# EAGLE design cpu_eval_board (EAGLE 6.3)

## Sheet 1 of 3
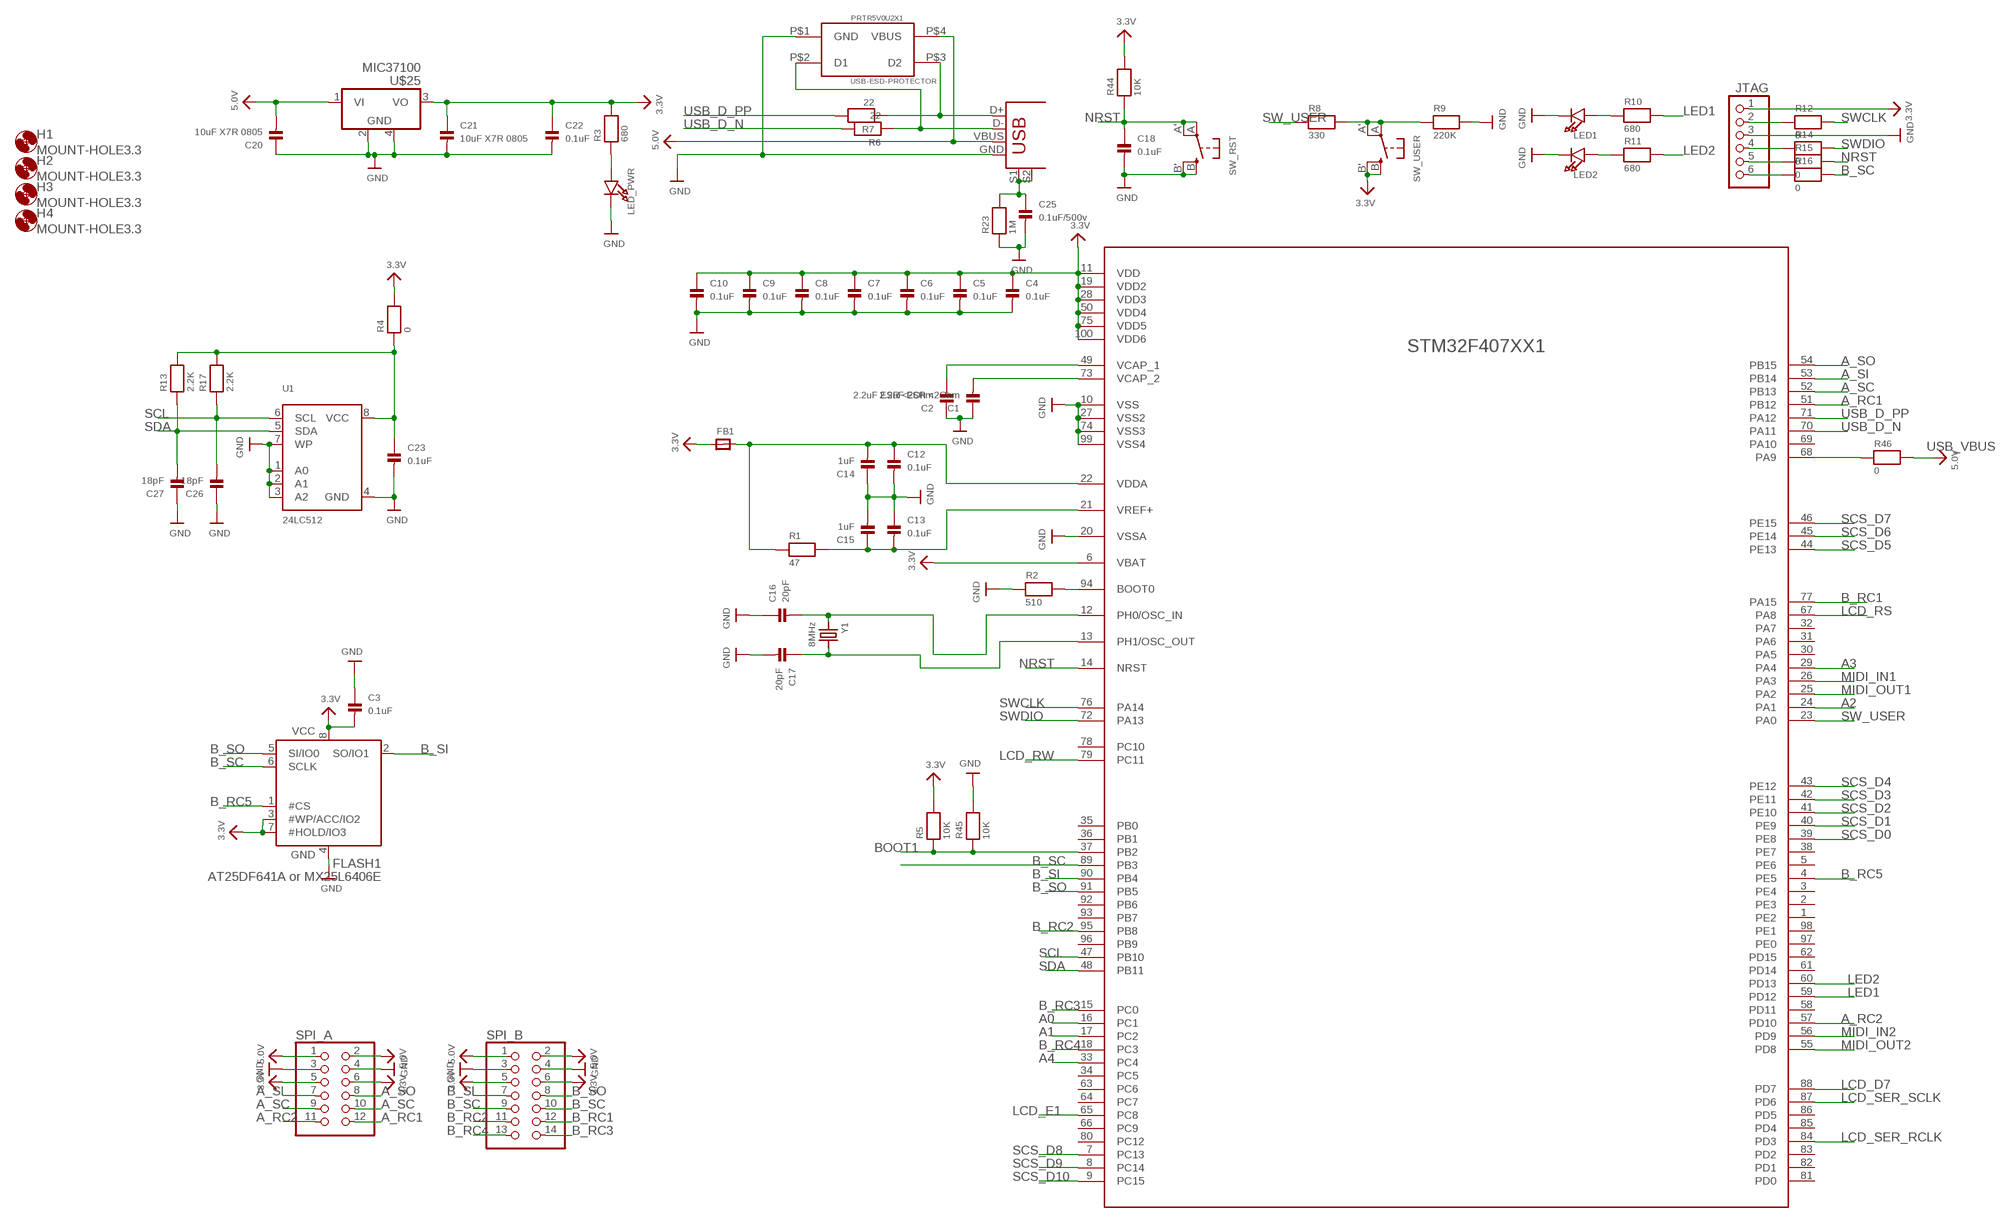
[diagram p0: schematic, sheet 1]

### Parts
C1  2.2uF ESR <2Ohm  CAP_CERAMIC0603  [0603]
C2  2.2uF ESR <2Ohm  CAP_CERAMIC0603  [0603]
C3  0.1uF  CAP_CERAMIC0603  [0603]
C4  0.1uF  CAP_CERAMIC0603  [0603]
C5  0.1uF  CAP_CERAMIC0603  [0603]
C6  0.1uF  CAP_CERAMIC0603  [0603]
C7  0.1uF  CAP_CERAMIC0603  [0603]
C8  0.1uF  CAP_CERAMIC0603  [0603]
C9  0.1uF  CAP_CERAMIC0603  [0603]
C10  0.1uF  CAP_CERAMIC0603  [0603]
C12  0.1uF  CAP_CERAMIC0603  [0603]
C13  0.1uF  CAP_CERAMIC0603  [0603]
C14  1uF  CAP_CERAMIC0603  [0603]
C15  1uF  CAP_CERAMIC0603  [0603]
C16  20pF  CAP_CERAMIC0603  [0603]
C17  20pF  CAP_CERAMIC0603  [0603]
C18  0.1uF  CAP_CERAMIC0603  [0603]
C20  10uF X7R 0805  CAP_CERAMIC_0805  [_0805]
C21  10uF X7R 0805  CAP_CERAMIC_0805  [_0805]
C22  0.1uF  CAP_CERAMIC0603  [0603]
C23  0.1uF  CAP_CERAMIC0603  [0603]
C25  0.1uF/500v  CAP_CERAMIC0603  [0603]
C26  18pF  CAP_CERAMIC0603  [0603]
C27  18pF  CAP_CERAMIC0603  [0603]
FB1  FERRITE_0805  [_0805]
FLASH1  AT25DF641A or MX25L6406E  FLASH-SPI  [SOIC-8-WIDE]
H1  MOUNT-HOLE3.3  [3,3]
H2  MOUNT-HOLE3.3  [3,3]
H3  MOUNT-HOLE3.3  [3,3]
H4  MOUNT-HOLE3.3  [3,3]
JTAG  HEADER-1X6ROUND  [1X06_ROUND]
LED1  LED0603  [CHIPLED_0603]
LED2  LED0603  [CHIPLED_0603]
LED_PWR  LED0603  [CHIPLED_0603]
PRTR5V0U2X1  USB-ESD-PROTECTOR  [PRTR5V0U2X]
R1  47  RESISTOR0603  [0603]
R2  510  RESISTOR0603  [0603]
R3  680  RESISTOR0603  [0603]
R4  0  RESISTOR0603  [0603]
R5  10K  RESISTOR0603  [0603]
R6  22  RESISTOR0603  [0603]
R7  22  RESISTOR0603  [0603]
R8  330  RESISTOR0603  [0603]
R9  220K  RESISTOR0603  [0603]
R10  680  RESISTOR0603  [0603]
R11  680  RESISTOR0603  [0603]
R12  0  RESISTOR0603  [0603]
R13  2.2K  RESISTOR0603  [0603]
R14  0  RESISTOR0603  [0603]
R15  0  RESISTOR0603  [0603]
R16  0  RESISTOR0603  [0603]
R17  2.2K  RESISTOR0603  [0603]
R23  1M  RESISTOR0603  [0603]
R44  10K  RESISTOR0603  [0603]
R45  10K  RESISTOR0603  [0603]
R46  0  RESISTOR0603  [0603]
SPI_A  PINHD-2X6  [2X06]
SPI_B  PINHD-2X7  [2X07]
STM32F407XX1  STM32F407  [100LQFP]
SW_RST  SWITCH_TACT_SMT  [EVQ-Q2]
SW_USER  SWITCH_TACT_SMT  [EVQ-Q2]
U1  24LC512  EEPROM_I2C_SOIC8_GENERIC  [SOIC8_150MIL]
U$14  Molex 67068-9001  USB+SHIELD  [USB-B-PTH]
U$25  MIC37100  [SOT223]
Y1  8MHz  CRYSTALSMD  [HC49UP]

### Nets
3.3V: C3.2 C4.1 C5.1 C6.1 C7.1 C8.1 C9.1 C10.1 C21.1 C22.1 FB1.1 FLASH1.3(#WP/ACC/IO2) FLASH1.7(#HOLD/IO3) FLASH1.8(VCC) JTAG.1 R3.2 R4.2 R5.2 R44.2 SPI_A.5 SPI_A.6 SPI_B.5 SPI_B.6 STM32F407XX1.6(VBAT) STM32F407XX1.11(VDD) STM32F407XX1.19(VDD2) STM32F407XX1.28(VDD3) STM32F407XX1.50(VDD4) STM32F407XX1.75(VDD5) STM32F407XX1.100(VDD6) SW_USER.B'(S1) SW_USER.B(S) U$25.3(VO) ; also sheet 2
5.0V: C20.2 PRTR5V0U2X1.P$4(VBUS) R46.2 SPI_A.1 SPI_A.2 SPI_B.1 SPI_B.2 U$14.VBUS U$25.1(VI) ; also sheet 2,3
A0: STM32F407XX1.16(PC1) ; also sheet 2
A1: STM32F407XX1.17(PC2) ; also sheet 2
A2: STM32F407XX1.24(PA1) ; also sheet 2
A3: STM32F407XX1.29(PA4) ; also sheet 2
A4: STM32F407XX1.33(PC4) ; also sheet 2
A_RC1: SPI_A.12 STM32F407XX1.51(PB12)
A_RC2: SPI_A.11 STM32F407XX1.57(PD10)
A_SC: SPI_A.9 SPI_A.10 STM32F407XX1.52(PB13)
A_SI: SPI_A.7 STM32F407XX1.53(PB14)
A_SO: SPI_A.8 STM32F407XX1.54(PB15)
B_RC1: SPI_B.12 STM32F407XX1.77(PA15)
B_RC2: SPI_B.11 STM32F407XX1.95(PB8)
B_RC3: SPI_B.14 STM32F407XX1.15(PC0)
B_RC4: SPI_B.13 STM32F407XX1.18(PC3)
B_RC5: FLASH1.1(#CS) STM32F407XX1.4(PE5)
B_SC: FLASH1.6(SCLK) R16.2 SPI_B.9 SPI_B.10 STM32F407XX1.89(PB3)
B_SI: FLASH1.2(SO/IO1) SPI_B.7 STM32F407XX1.90(PB4)
B_SO: FLASH1.5(SI/IO0) SPI_B.8 STM32F407XX1.91(PB5)
BOOT1: R5.1 R45.1 STM32F407XX1.37(PB2)
GND: C1.1 C2.1 C3.1 C4.2 C5.2 C6.2 C7.2 C8.2 C9.2 C10.2 C12.2 C13.1 C14.1 C15.2 C16.1 C17.2 C18.2 C20.1 C21.2 C22.2 C23.2 C25.2 C26.1 C27.1 FLASH1.4(GND) JTAG.3 LED1.C LED2.C LED_PWR.C PRTR5V0U2X1.P$1(GND) R2.1 R9.2 R23.1 R45.2 SPI_A.3 SPI_A.4 SPI_B.3 SPI_B.4 STM32F407XX1.10(VSS) STM32F407XX1.20(VSSA) STM32F407XX1.27(VSS2) STM32F407XX1.74(VSS3) STM32F407XX1.99(VSS4) SW_RST.B'(S1) SW_RST.B(S) U1.1(A0) U1.2(A1) U1.3(A2) U1.4(GND) U1.7(WP) U$14.GND U$25.2(GND) U$25.4(GND_TAB) ; also sheet 2,3
LCD_D7: STM32F407XX1.88(PD7) ; also sheet 2
LCD_E1: STM32F407XX1.65(PC8) ; also sheet 2
LCD_RS: STM32F407XX1.67(PA8) ; also sheet 2
LCD_RW: STM32F407XX1.79(PC11) ; also sheet 2
LCD_SER_RCLK: STM32F407XX1.84(PD3) ; also sheet 2
LCD_SER_SCLK: STM32F407XX1.87(PD6) ; also sheet 2
LED1: R10.2 STM32F407XX1.59(PD12)
LED2: R11.2 STM32F407XX1.60(PD13)
MIDI_IN1: STM32F407XX1.26(PA3) ; also sheet 3
MIDI_IN2: STM32F407XX1.56(PD9) ; also sheet 3
MIDI_OUT1: STM32F407XX1.25(PA2) ; also sheet 3
MIDI_OUT2: STM32F407XX1.55(PD8) ; also sheet 3
N$1: C2.2 STM32F407XX1.49(VCAP_1)
N$2: C1.2 STM32F407XX1.73(VCAP_2)
N$3: R46.1 STM32F407XX1.68(PA9)
N$5: R2.2 STM32F407XX1.94(BOOT0)
N$6: C16.2 STM32F407XX1.12(PH0/OSC_IN) Y1.1
N$7: C23.1 R4.1 R13.2 R17.2 U1.8(VCC)
N$8: LED_PWR.A R3.1
N$9: C17.1 STM32F407XX1.13(PH1/OSC_OUT) Y1.2
N$10: PRTR5V0U2X1.P$2(D1) R6.1 U$14.D-
N$11: PRTR5V0U2X1.P$3(D2) R7.1 U$14.D+
N$12: R8.2 R9.1 SW_USER.A'(P1) SW_USER.A(P)
N$13: LED1.A R10.1
N$14: LED2.A R11.1
N$15: JTAG.2 R12.1
N$16: JTAG.4 R14.1
N$17: JTAG.5 R15.1
N$18: JTAG.6 R16.1
N$21: C25.1 R23.2 U$14.S1 U$14.S2
NRST: C18.1 R15.2 R44.1 STM32F407XX1.14(NRST) SW_RST.A'(P1) SW_RST.A(P)
SCL: C26.2 R17.1 STM32F407XX1.47(PB10) U1.6(SCL)
SCS_D0: STM32F407XX1.39(PE8) ; also sheet 2
SCS_D1: STM32F407XX1.40(PE9) ; also sheet 2
SCS_D2: STM32F407XX1.41(PE10) ; also sheet 2
SCS_D3: STM32F407XX1.42(PE11) ; also sheet 2
SCS_D4: STM32F407XX1.43(PE12) ; also sheet 2
SCS_D5: STM32F407XX1.44(PE13) ; also sheet 2
SCS_D6: STM32F407XX1.45(PE14) ; also sheet 2
SCS_D7: STM32F407XX1.46(PE15) ; also sheet 2
SCS_D8: STM32F407XX1.7(PC13) ; also sheet 2
SCS_D9: STM32F407XX1.8(PC14) ; also sheet 2
SCS_D10: STM32F407XX1.9(PC15) ; also sheet 2
SDA: C27.2 R13.1 STM32F407XX1.48(PB11) U1.5(SDA)
SW_USER: R8.1 STM32F407XX1.23(PA0)
SWCLK: R12.2 STM32F407XX1.76(PA14)
SWDIO: R14.2 STM32F407XX1.72(PA13)
USB_D_N: R6.2 STM32F407XX1.70(PA11)
USB_D_PP: R7.2 STM32F407XX1.71(PA12)
VDDA: C12.1 C14.2 FB1.2 R1.1 STM32F407XX1.22(VDDA)
VREF: C13.2 C15.1 R1.2 STM32F407XX1.21(VREF+)
Unconnected: STM32F407XX1.1(PE2) STM32F407XX1.2(PE3) STM32F407XX1.3(PE4) STM32F407XX1.5(PE6) STM32F407XX1.30(PA5) STM32F407XX1.31(PA6) STM32F407XX1.32(PA7) STM32F407XX1.34(PC5) STM32F407XX1.35(PB0) STM32F407XX1.36(PB1) STM32F407XX1.38(PE7) STM32F407XX1.58(PD11) STM32F407XX1.61(PD14) STM32F407XX1.62(PD15) STM32F407XX1.63(PC6) STM32F407XX1.64(PC7) STM32F407XX1.66(PC9) STM32F407XX1.69(PA10) STM32F407XX1.78(PC10) STM32F407XX1.80(PC12) STM32F407XX1.81(PD0) STM32F407XX1.82(PD1) STM32F407XX1.83(PD2) STM32F407XX1.85(PD4) STM32F407XX1.86(PD5) STM32F407XX1.92(PB6) STM32F407XX1.93(PB7) STM32F407XX1.96(PB9) STM32F407XX1.97(PE0) STM32F407XX1.98(PE1)

### Notes on the sheet
- USB_VBUS

## Sheet 2 of 3
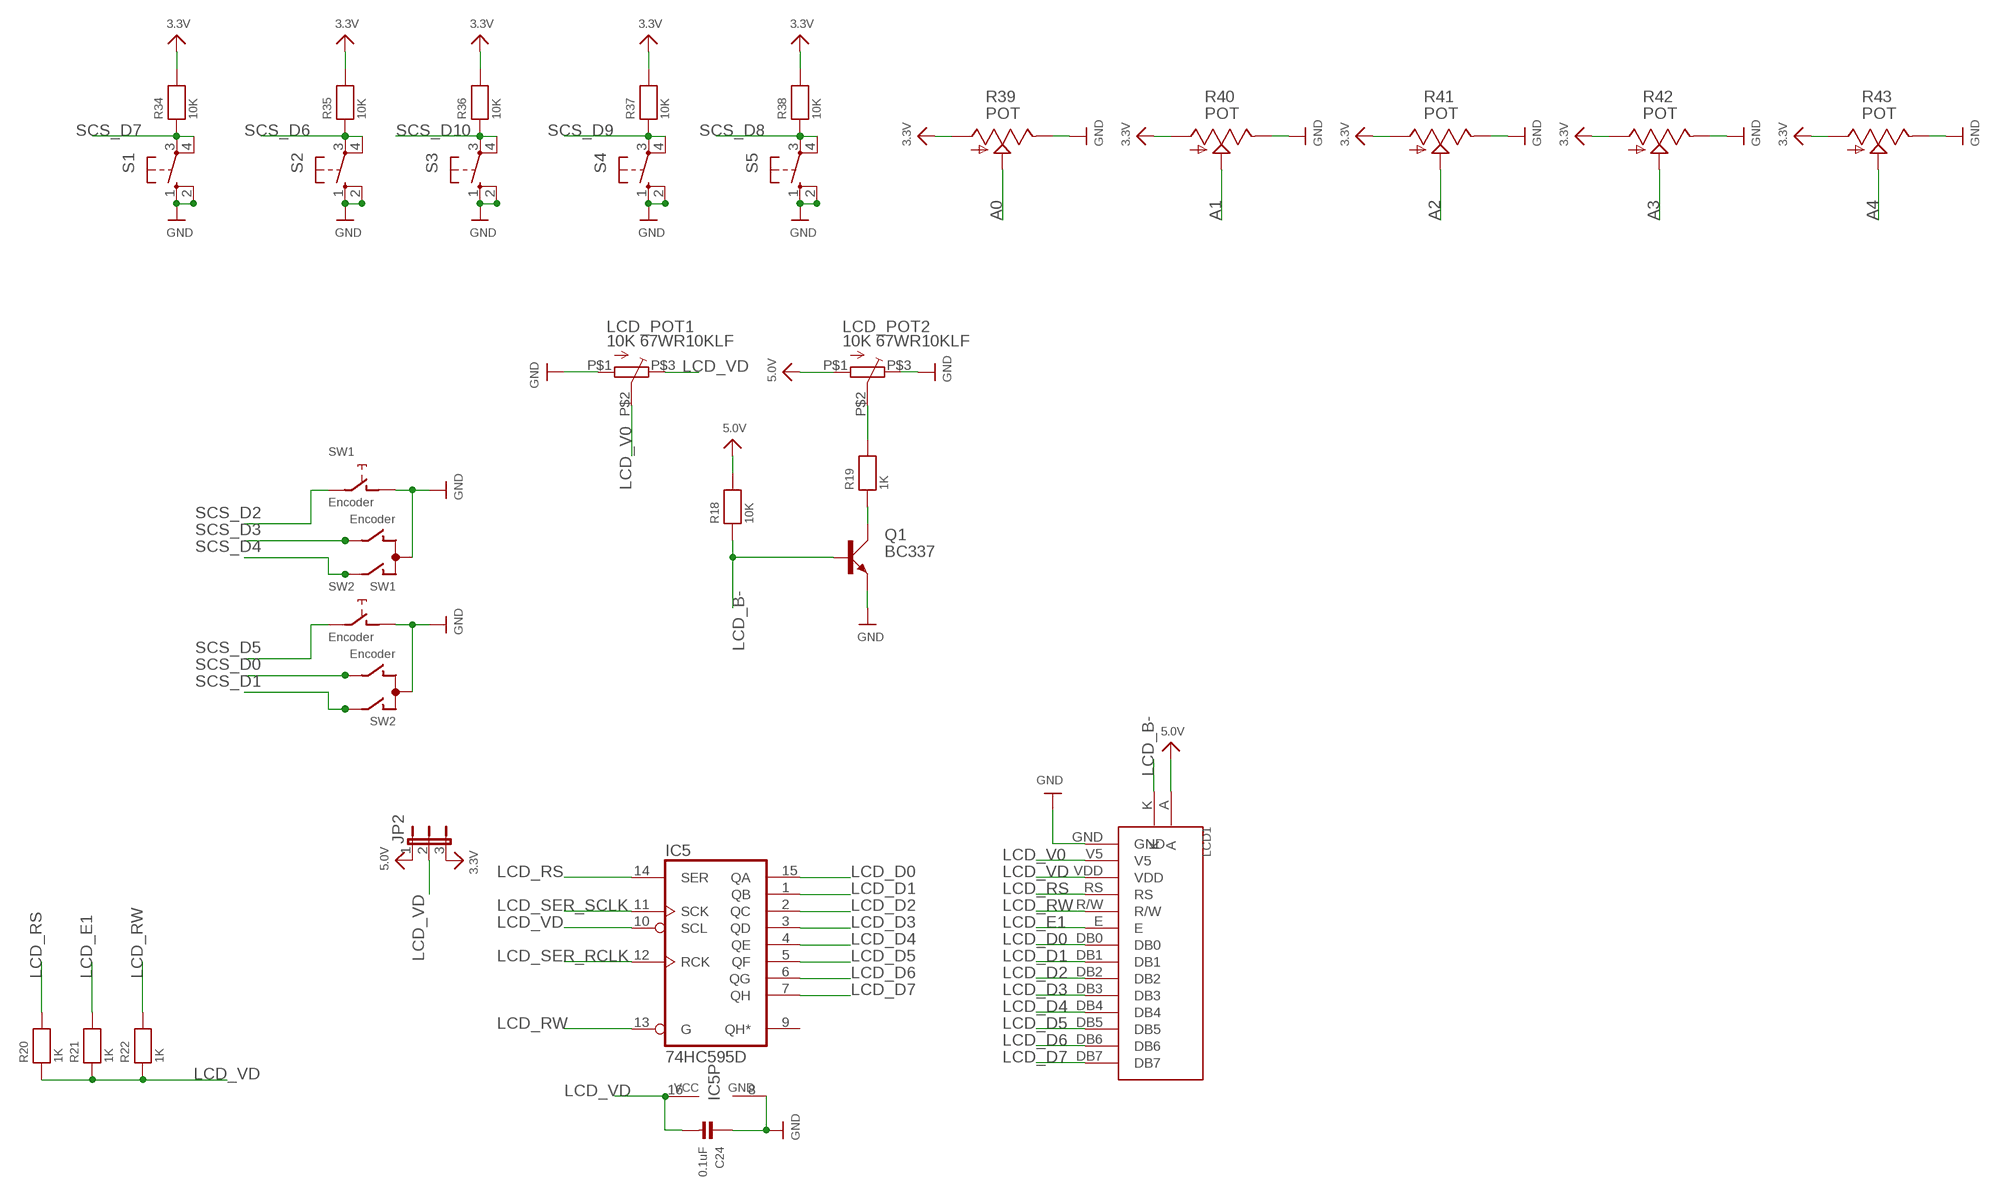
[diagram p1: schematic, sheet 2]

### Parts
C24  0.1uF  CAP_CERAMIC0603  [0603]
IC5  74HC595D  [SO16]
JP2  JUMPER3  [JUMPER3]
LCD1  NHD-C0220AA-FSW-FTW  [NHD-C0220AA-FSW-FTW]
LCD_POT1  10K 67WR10KLF  TRIMPOT-67W  [67W]
LCD_POT2  10K 67WR10KLF  TRIMPOT-67W  [67W]
Q1  BC337  [SOT54A]
R18  10K  RESISTOR_0603  [_0603]
R19  1K  RESISTOR_0603  [_0603]
R20  1K  RESISTOR_0603  [_0603]
R21  1K  RESISTOR_0603  [_0603]
R22  1K  RESISTOR_0603  [_0603]
R34  10K  RESISTOR_0603  [_0603]
R35  10K  RESISTOR_0603  [_0603]
R36  10K  RESISTOR_0603  [_0603]
R37  10K  RESISTOR_0603  [_0603]
R38  10K  RESISTOR_0603  [_0603]
R39  POT  POT_US  [ALPS_POT_SFE]
R40  POT  POT_US  [ALPS_POT_SFE]
R41  POT  POT_US  [ALPS_POT_SFE]
R42  POT  POT_US  [ALPS_POT_SFE]
R43  POT  POT_US  [ALPS_POT_SFE]
S1  40-XX  [B3F-40XX]
S2  40-XX  [B3F-40XX]
S3  40-XX  [B3F-40XX]
S4  40-XX  [B3F-40XX]
S5  40-XX  [B3F-40XX]
SW1  Encoder  EC12E_SW  [ALPS_EC12E_SW]
SW2  Encoder  EC12E_SW  [ALPS_EC12E_SW]

### Nets
3.3V: JP2.3 R34.2 R35.2 R36.2 R37.2 R38.2 R39.P$3(A) R40.P$3(A) R41.P$3(A) R42.P$3(A) R43.P$3(A) ; also sheet 1
5.0V: JP2.1 LCD1.A LCD_POT2.P$1(A) R18.2 ; also sheet 1,3
A0: R39.P$2(S) ; also sheet 1
A1: R40.P$2(S) ; also sheet 1
A2: R41.P$2(S) ; also sheet 1
A3: R42.P$2(S) ; also sheet 1
A4: R43.P$2(S) ; also sheet 1
GND: C24.1 IC5.8(GND) LCD1.GND LCD_POT1.P$1(A) LCD_POT2.P$3(E) Q1.E R39.P$1(E) R40.P$1(E) R41.P$1(E) R42.P$1(E) R43.P$1(E) S1.1(S) S1.2(S1) S2.1(S) S2.2(S1) S3.1(S) S3.2(S1) S4.1(S) S4.2(S1) S5.1(S) S5.2(S1) SW1.C SW1.D SW2.C SW2.D ; also sheet 1,3
LCD_B-: LCD1.K Q1.B R18.1
LCD_D0: IC5.15(QA) LCD1.DB0
LCD_D1: IC5.1(QB) LCD1.DB1
LCD_D2: IC5.2(QC) LCD1.DB2
LCD_D3: IC5.3(QD) LCD1.DB3
LCD_D4: IC5.4(QE) LCD1.DB4
LCD_D5: IC5.5(QF) LCD1.DB5
LCD_D6: IC5.6(QG) LCD1.DB6
LCD_D7: IC5.7(QH) LCD1.DB7 ; also sheet 1
LCD_E1: LCD1.E R21.2 ; also sheet 1
LCD_RS: IC5.14(SER) LCD1.RS R20.2 ; also sheet 1
LCD_RW: IC5.13(G) LCD1.R/W R22.2 ; also sheet 1
LCD_SER_RCLK: IC5.12(RCK) ; also sheet 1
LCD_SER_SCLK: IC5.11(SCK) ; also sheet 1
LCD_V0: LCD1.V5 LCD_POT1.P$2(S)
LCD_VD: C24.2 IC5.10(SCL) IC5.16(VCC) JP2.2 LCD1.VDD LCD_POT1.P$3(E) R20.1 R21.1 R22.1
N$19: Q1.C R19.1
N$20: LCD_POT2.P$2(S) R19.2
SCS_D0: SW2.B ; also sheet 1
SCS_D1: SW2.A ; also sheet 1
SCS_D2: SW1.E ; also sheet 1
SCS_D3: SW1.B ; also sheet 1
SCS_D4: SW1.A ; also sheet 1
SCS_D5: SW2.E ; also sheet 1
SCS_D6: R35.1 S2.3(P) S2.4(P1) ; also sheet 1
SCS_D7: R34.1 S1.3(P) S1.4(P1) ; also sheet 1
SCS_D8: R38.1 S5.3(P) S5.4(P1) ; also sheet 1
SCS_D9: R37.1 S4.3(P) S4.4(P1) ; also sheet 1
SCS_D10: R36.1 S3.3(P) S3.4(P1) ; also sheet 1
Unconnected: IC5.9(QH*) SW1.GND1(G) SW1.GND2(G) SW2.GND1(G) SW2.GND2(G)

## Sheet 3 of 3
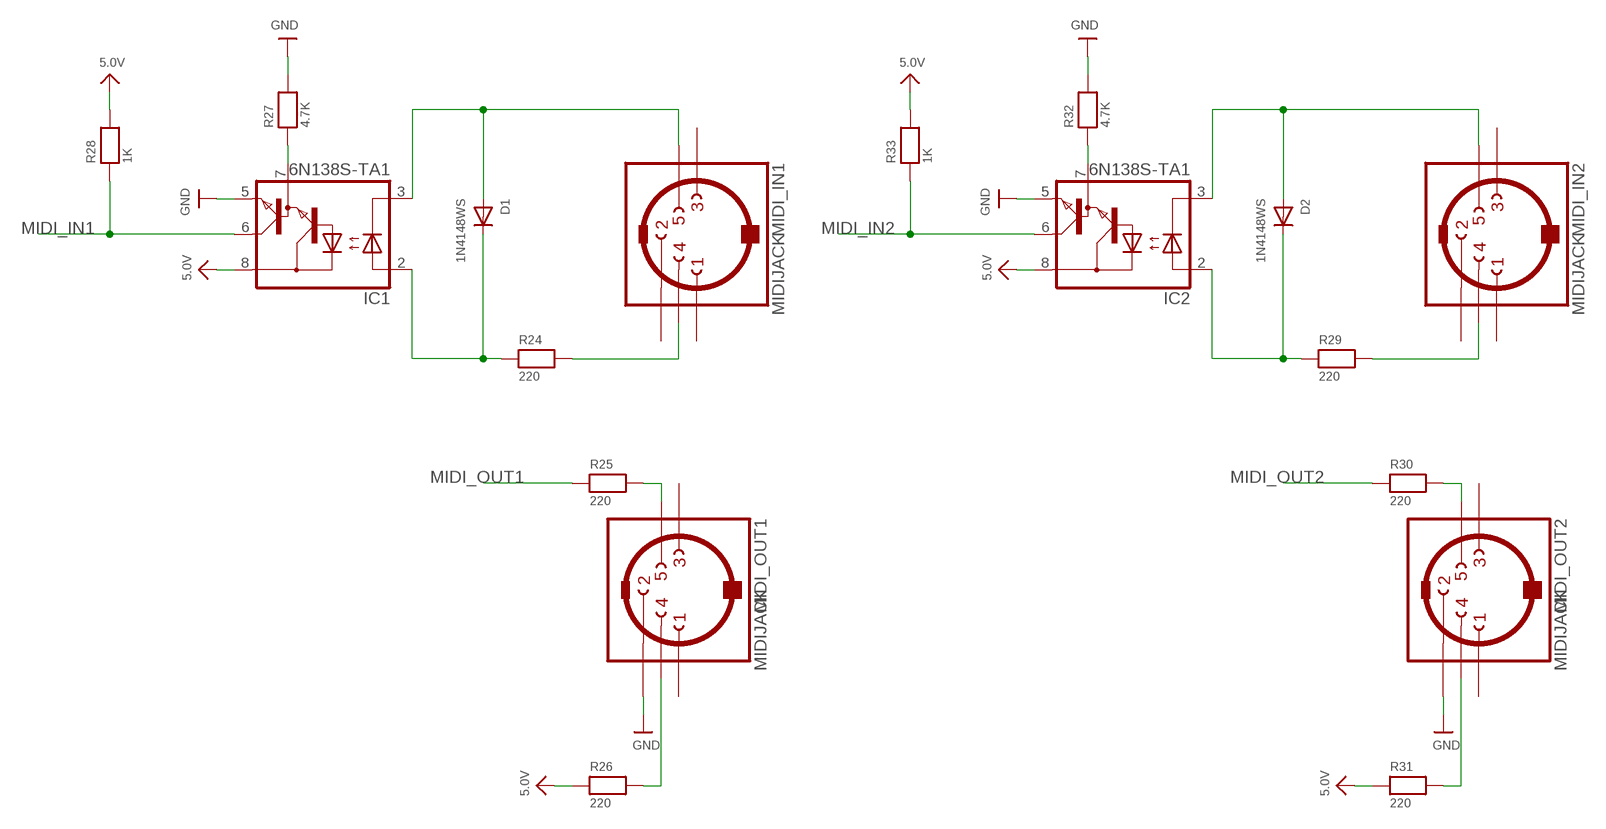
[diagram p2: schematic, sheet 3]

### Parts
D1  1N4148WS  DIODESOD-323  [SOD-323]
D2  1N4148WS  DIODESOD-323  [SOD-323]
IC1  6N138S-TA1  6N138SMD  [SO8-GW300]
IC2  6N138S-TA1  6N138SMD  [SO8-GW300]
MIDI_IN1  MIDIJACK  [CP-2350]
MIDI_IN2  MIDIJACK  [CP-2350]
MIDI_OUT1  MIDIJACK  [CP-2350]
MIDI_OUT2  MIDIJACK  [CP-2350]
R24  220  RESISTOR_0603  [_0603]
R25  220  RESISTOR_0603  [_0603]
R26  220  RESISTOR_0603  [_0603]
R27  4.7K  RESISTOR_0603  [_0603]
R28  1K  RESISTOR_0603  [_0603]
R29  220  RESISTOR_0603  [_0603]
R30  220  RESISTOR_0603  [_0603]
R31  220  RESISTOR_0603  [_0603]
R32  4.7K  RESISTOR_0603  [_0603]
R33  1K  RESISTOR_0603  [_0603]

### Nets
5.0V: IC1.8(VCC) IC2.8(VCC) R26.1 R28.2 R31.1 R33.2 ; also sheet 1,2
GND: IC1.5(GND) IC2.5(GND) MIDI_OUT1.2 MIDI_OUT2.2 R27.2 R32.2 ; also sheet 1,2
MIDI_IN1: IC1.6(VO) R28.1 ; also sheet 1
MIDI_IN2: IC2.6(VO) R33.1 ; also sheet 1
MIDI_OUT1: R25.1 ; also sheet 1
MIDI_OUT2: R30.1 ; also sheet 1
N$23: MIDI_OUT1.5 R25.2
N$24: MIDI_OUT1.4 R26.2
N$25: MIDI_IN1.4 R24.2
N$26: D1.C IC1.2(A) R24.1
N$27: D1.A IC1.3(C) MIDI_IN1.5
N$28: IC1.7(VB) R27.1
N$29: MIDI_OUT2.5 R30.2
N$30: MIDI_OUT2.4 R31.2
N$31: MIDI_IN2.4 R29.2
N$32: D2.C IC2.2(A) R29.1
N$33: D2.A IC2.3(C) MIDI_IN2.5
N$34: IC2.7(VB) R32.1
Unconnected: MIDI_IN1.1 MIDI_IN1.2 MIDI_IN1.3 MIDI_IN2.1 MIDI_IN2.2 MIDI_IN2.3 MIDI_OUT1.1 MIDI_OUT1.3 MIDI_OUT2.1 MIDI_OUT2.3

## Library data of the parts
C1 C2 = microbuilder:CAP_CERAMIC: Ceramic Capacitors 0402 - 0402 Surface Mount Capacitors 16pF 50V 5% [Digikey: 445-4899-2-ND] 18pF 50V 5% [Digikey: 490-1281-2-ND] 22pF 50V 5% [Digikey: 490-1283-2-ND] 68pF 50V 5% [Digikey: 490-1289-2-ND] 0.1uF 10V 10% [Digikey: 490-1318-2-ND] 1.0uF 6.3V 10% [Digikey: 490-1320-2-ND] 0603 - 0603 Surface Mount Capacitors 16 pF 50V 5% [Digikey: 445-5051-2-ND] 22 pF 50V [Digikey: PCC220ACVTR-ND] 33 pF 50V 5% [Digikey: 490-1415-1-ND] 56pF 50V 5% [Digikey: 490-1421-1-ND] 220pF 50V 5% [Digikey: 445-1285-1-ND] 680 pF 50V 2200 pF 50V 5% C0G [Digikey: 445-1297-1-ND] 5600 pF 100V 5% X7R [Digikey: 478-3711-1-ND] 0.1 µF 25V 10% [Digikey: PCC2277TR-ND] 0.22 µF 16V 10% X7R [Digikey: 445-1318-1-ND] 1.0 µF 25V 10% [Digikey: 445-5146-2-ND] 0603 - RF Specific 3pF 250V +/-0.1pF RF [Digikey: 712-1347-1-ND] 18 pF 250V 5% [Digikey: 478-3505-1-ND or 712-1322-1-ND] 56 pF 250V 5% C0G RF [Digikey: 490-4867-1-ND] 68 pF 250V RF [Digikey: 490-4868-1-ND] 0805 - 0805 Surface Mount Capacitors 220 pF 250V 2% RF Ceramic Capacitor [Digikey: 712-1398-1-ND] 1000 pF 50V 2% NP0 Ceramic Capacitor [Digikey: 478-3760-1-ND] 0.1 µF 25V 10% Ceramic Capacitor [Digikey: PCC1828TR-ND] 1.0 µF 16V 10% Ceramic Capacitor[Digikey: 490-1691-2-ND] 10.0 µF 10V 10% Ceramic Capacitor[Digikey: 709-1228-1-ND] 10.0 uF 16V 10% Ceramic Capacitor [Digikey: 478-5165-2-ND] 47 uF 6.3V 20% Ceramic Capacitor [Digikey: 587-1779-1-ND or 399-5506-1-ND] 1206 - 1206 Surface Mount Capacitors 47uF 10V 20% Ceramic Capacitor [Digikey: 490-5528-1-ND or 399-5508-1-ND or 445-6010-1-ND] 100uF 6.3V -20%, +80% Y5V Ceramic Capacitor (Digikey: 490-4512-1-ND, Mouser: 81-GRM31CF50J107ZE1L); PARTNO: GRM188R61E225KA12D,Murata Electronics,,81-GRM188R61E225KA2D,Multilayer Ceramic Capacitors MLCC - SMD/SMT 0603 2.2uF 25volts X5R 10%, REF25
C3-C10 C12 C13 C18 C22-C24 = microbuilder:CAP_CERAMIC: Ceramic Capacitors 0402 - 0402 Surface Mount Capacitors 16pF 50V 5% [Digikey: 445-4899-2-ND] 18pF 50V 5% [Digikey: 490-1281-2-ND] 22pF 50V 5% [Digikey: 490-1283-2-ND] 68pF 50V 5% [Digikey: 490-1289-2-ND] 0.1uF 10V 10% [Digikey: 490-1318-2-ND] 1.0uF 6.3V 10% [Digikey: 490-1320-2-ND] 0603 - 0603 Surface Mount Capacitors 16 pF 50V 5% [Digikey: 445-5051-2-ND] 22 pF 50V [Digikey: PCC220ACVTR-ND] 33 pF 50V 5% [Digikey: 490-1415-1-ND] 56pF 50V 5% [Digikey: 490-1421-1-ND] 220pF 50V 5% [Digikey: 445-1285-1-ND] 680 pF 50V 2200 pF 50V 5% C0G [Digikey: 445-1297-1-ND] 5600 pF 100V 5% X7R [Digikey: 478-3711-1-ND] 0.1 µF 25V 10% [Digikey: PCC2277TR-ND] 0.22 µF 16V 10% X7R [Digikey: 445-1318-1-ND] 1.0 µF 25V 10% [Digikey: 445-5146-2-ND] 0603 - RF Specific 3pF 250V +/-0.1pF RF [Digikey: 712-1347-1-ND] 18 pF 250V 5% [Digikey: 478-3505-1-ND or 712-1322-1-ND] 56 pF 250V 5% C0G RF [Digikey: 490-4867-1-ND] 68 pF 250V RF [Digikey: 490-4868-1-ND] 0805 - 0805 Surface Mount Capacitors 220 pF 250V 2% RF Ceramic Capacitor [Digikey: 712-1398-1-ND] 1000 pF 50V 2% NP0 Ceramic Capacitor [Digikey: 478-3760-1-ND] 0.1 µF 25V 10% Ceramic Capacitor [Digikey: PCC1828TR-ND] 1.0 µF 16V 10% Ceramic Capacitor[Digikey: 490-1691-2-ND] 10.0 µF 10V 10% Ceramic Capacitor[Digikey: 709-1228-1-ND] 10.0 uF 16V 10% Ceramic Capacitor [Digikey: 478-5165-2-ND] 47 uF 6.3V 20% Ceramic Capacitor [Digikey: 587-1779-1-ND or 399-5506-1-ND] 1206 - 1206 Surface Mount Capacitors 47uF 10V 20% Ceramic Capacitor [Digikey: 490-5528-1-ND or 399-5508-1-ND or 445-6010-1-ND] 100uF 6.3V -20%, +80% Y5V Ceramic Capacitor (Digikey: 490-4512-1-ND, Mouser: 81-GRM31CF50J107ZE1L); PARTNO: VJ0603Y104JXJPW1BC,Vishay / Vitramon,,77-VJ0603Y104JXJPBC,Multilayer Ceramic Capacitors MLCC - SMD/SMT 0603 0.1uF 16volts X7R 5%, REF44
C14 C15 = microbuilder:CAP_CERAMIC: Ceramic Capacitors 0402 - 0402 Surface Mount Capacitors 16pF 50V 5% [Digikey: 445-4899-2-ND] 18pF 50V 5% [Digikey: 490-1281-2-ND] 22pF 50V 5% [Digikey: 490-1283-2-ND] 68pF 50V 5% [Digikey: 490-1289-2-ND] 0.1uF 10V 10% [Digikey: 490-1318-2-ND] 1.0uF 6.3V 10% [Digikey: 490-1320-2-ND] 0603 - 0603 Surface Mount Capacitors 16 pF 50V 5% [Digikey: 445-5051-2-ND] 22 pF 50V [Digikey: PCC220ACVTR-ND] 33 pF 50V 5% [Digikey: 490-1415-1-ND] 56pF 50V 5% [Digikey: 490-1421-1-ND] 220pF 50V 5% [Digikey: 445-1285-1-ND] 680 pF 50V 2200 pF 50V 5% C0G [Digikey: 445-1297-1-ND] 5600 pF 100V 5% X7R [Digikey: 478-3711-1-ND] 0.1 µF 25V 10% [Digikey: PCC2277TR-ND] 0.22 µF 16V 10% X7R [Digikey: 445-1318-1-ND] 1.0 µF 25V 10% [Digikey: 445-5146-2-ND] 0603 - RF Specific 3pF 250V +/-0.1pF RF [Digikey: 712-1347-1-ND] 18 pF 250V 5% [Digikey: 478-3505-1-ND or 712-1322-1-ND] 56 pF 250V 5% C0G RF [Digikey: 490-4867-1-ND] 68 pF 250V RF [Digikey: 490-4868-1-ND] 0805 - 0805 Surface Mount Capacitors 220 pF 250V 2% RF Ceramic Capacitor [Digikey: 712-1398-1-ND] 1000 pF 50V 2% NP0 Ceramic Capacitor [Digikey: 478-3760-1-ND] 0.1 µF 25V 10% Ceramic Capacitor [Digikey: PCC1828TR-ND] 1.0 µF 16V 10% Ceramic Capacitor[Digikey: 490-1691-2-ND] 10.0 µF 10V 10% Ceramic Capacitor[Digikey: 709-1228-1-ND] 10.0 uF 16V 10% Ceramic Capacitor [Digikey: 478-5165-2-ND] 47 uF 6.3V 20% Ceramic Capacitor [Digikey: 587-1779-1-ND or 399-5506-1-ND] 1206 - 1206 Surface Mount Capacitors 47uF 10V 20% Ceramic Capacitor [Digikey: 490-5528-1-ND or 399-5508-1-ND or 445-6010-1-ND] 100uF 6.3V -20%, +80% Y5V Ceramic Capacitor (Digikey: 490-4512-1-ND, Mouser: 81-GRM31CF50J107ZE1L); PARTNO: GRM188R61E105KA12D,Murata Electronics,,81-GRM188R61E105KA12,Multilayer Ceramic Capacitors MLCC - SMD/SMT 0603 1uF 25volts X5R 10%, REF23
C16 C17 = microbuilder:CAP_CERAMIC: Ceramic Capacitors 0402 - 0402 Surface Mount Capacitors 16pF 50V 5% [Digikey: 445-4899-2-ND] 18pF 50V 5% [Digikey: 490-1281-2-ND] 22pF 50V 5% [Digikey: 490-1283-2-ND] 68pF 50V 5% [Digikey: 490-1289-2-ND] 0.1uF 10V 10% [Digikey: 490-1318-2-ND] 1.0uF 6.3V 10% [Digikey: 490-1320-2-ND] 0603 - 0603 Surface Mount Capacitors 16 pF 50V 5% [Digikey: 445-5051-2-ND] 22 pF 50V [Digikey: PCC220ACVTR-ND] 33 pF 50V 5% [Digikey: 490-1415-1-ND] 56pF 50V 5% [Digikey: 490-1421-1-ND] 220pF 50V 5% [Digikey: 445-1285-1-ND] 680 pF 50V 2200 pF 50V 5% C0G [Digikey: 445-1297-1-ND] 5600 pF 100V 5% X7R [Digikey: 478-3711-1-ND] 0.1 µF 25V 10% [Digikey: PCC2277TR-ND] 0.22 µF 16V 10% X7R [Digikey: 445-1318-1-ND] 1.0 µF 25V 10% [Digikey: 445-5146-2-ND] 0603 - RF Specific 3pF 250V +/-0.1pF RF [Digikey: 712-1347-1-ND] 18 pF 250V 5% [Digikey: 478-3505-1-ND or 712-1322-1-ND] 56 pF 250V 5% C0G RF [Digikey: 490-4867-1-ND] 68 pF 250V RF [Digikey: 490-4868-1-ND] 0805 - 0805 Surface Mount Capacitors 220 pF 250V 2% RF Ceramic Capacitor [Digikey: 712-1398-1-ND] 1000 pF 50V 2% NP0 Ceramic Capacitor [Digikey: 478-3760-1-ND] 0.1 µF 25V 10% Ceramic Capacitor [Digikey: PCC1828TR-ND] 1.0 µF 16V 10% Ceramic Capacitor[Digikey: 490-1691-2-ND] 10.0 µF 10V 10% Ceramic Capacitor[Digikey: 709-1228-1-ND] 10.0 uF 16V 10% Ceramic Capacitor [Digikey: 478-5165-2-ND] 47 uF 6.3V 20% Ceramic Capacitor [Digikey: 587-1779-1-ND or 399-5506-1-ND] 1206 - 1206 Surface Mount Capacitors 47uF 10V 20% Ceramic Capacitor [Digikey: 490-5528-1-ND or 399-5508-1-ND or 445-6010-1-ND] 100uF 6.3V -20%, +80% Y5V Ceramic Capacitor (Digikey: 490-4512-1-ND, Mouser: 81-GRM31CF50J107ZE1L); PARTNO: GRM1885C1H200JA01D,Murata Electronics,,81-GRM39C200J50,Multilayer Ceramic Capacitors MLCC - SMD/SMT 0603 20pF 50volts C0G 5%, REF31
C20 C21 = microbuilder:CAP_CERAMIC: Ceramic Capacitors 0402 - 0402 Surface Mount Capacitors 16pF 50V 5% [Digikey: 445-4899-2-ND] 18pF 50V 5% [Digikey: 490-1281-2-ND] 22pF 50V 5% [Digikey: 490-1283-2-ND] 68pF 50V 5% [Digikey: 490-1289-2-ND] 0.1uF 10V 10% [Digikey: 490-1318-2-ND] 1.0uF 6.3V 10% [Digikey: 490-1320-2-ND] 0603 - 0603 Surface Mount Capacitors 16 pF 50V 5% [Digikey: 445-5051-2-ND] 22 pF 50V [Digikey: PCC220ACVTR-ND] 33 pF 50V 5% [Digikey: 490-1415-1-ND] 56pF 50V 5% [Digikey: 490-1421-1-ND] 220pF 50V 5% [Digikey: 445-1285-1-ND] 680 pF 50V 2200 pF 50V 5% C0G [Digikey: 445-1297-1-ND] 5600 pF 100V 5% X7R [Digikey: 478-3711-1-ND] 0.1 µF 25V 10% [Digikey: PCC2277TR-ND] 0.22 µF 16V 10% X7R [Digikey: 445-1318-1-ND] 1.0 µF 25V 10% [Digikey: 445-5146-2-ND] 0603 - RF Specific 3pF 250V +/-0.1pF RF [Digikey: 712-1347-1-ND] 18 pF 250V 5% [Digikey: 478-3505-1-ND or 712-1322-1-ND] 56 pF 250V 5% C0G RF [Digikey: 490-4867-1-ND] 68 pF 250V RF [Digikey: 490-4868-1-ND] 0805 - 0805 Surface Mount Capacitors 220 pF 250V 2% RF Ceramic Capacitor [Digikey: 712-1398-1-ND] 1000 pF 50V 2% NP0 Ceramic Capacitor [Digikey: 478-3760-1-ND] 0.1 µF 25V 10% Ceramic Capacitor [Digikey: PCC1828TR-ND] 1.0 µF 16V 10% Ceramic Capacitor[Digikey: 490-1691-2-ND] 10.0 µF 10V 10% Ceramic Capacitor[Digikey: 709-1228-1-ND] 10.0 uF 16V 10% Ceramic Capacitor [Digikey: 478-5165-2-ND] 47 uF 6.3V 20% Ceramic Capacitor [Digikey: 587-1779-1-ND or 399-5506-1-ND] 1206 - 1206 Surface Mount Capacitors 47uF 10V 20% Ceramic Capacitor [Digikey: 490-5528-1-ND or 399-5508-1-ND or 445-6010-1-ND] 100uF 6.3V -20%, +80% Y5V Ceramic Capacitor (Digikey: 490-4512-1-ND, Mouser: 81-GRM31CF50J107ZE1L); PARTNO: GRM21BR71A106KA73L,Murata Electronics,,81-GRM21BR71A106KA3L,Multilayer Ceramic Capacitors MLCC - SMD/SMT 0805 10uF 10volts X7R + - 10%, REF29
C25 = microbuilder:CAP_CERAMIC: Ceramic Capacitors 0402 - 0402 Surface Mount Capacitors 16pF 50V 5% [Digikey: 445-4899-2-ND] 18pF 50V 5% [Digikey: 490-1281-2-ND] 22pF 50V 5% [Digikey: 490-1283-2-ND] 68pF 50V 5% [Digikey: 490-1289-2-ND] 0.1uF 10V 10% [Digikey: 490-1318-2-ND] 1.0uF 6.3V 10% [Digikey: 490-1320-2-ND] 0603 - 0603 Surface Mount Capacitors 16 pF 50V 5% [Digikey: 445-5051-2-ND] 22 pF 50V [Digikey: PCC220ACVTR-ND] 33 pF 50V 5% [Digikey: 490-1415-1-ND] 56pF 50V 5% [Digikey: 490-1421-1-ND] 220pF 50V 5% [Digikey: 445-1285-1-ND] 680 pF 50V 2200 pF 50V 5% C0G [Digikey: 445-1297-1-ND] 5600 pF 100V 5% X7R [Digikey: 478-3711-1-ND] 0.1 µF 25V 10% [Digikey: PCC2277TR-ND] 0.22 µF 16V 10% X7R [Digikey: 445-1318-1-ND] 1.0 µF 25V 10% [Digikey: 445-5146-2-ND] 0603 - RF Specific 3pF 250V +/-0.1pF RF [Digikey: 712-1347-1-ND] 18 pF 250V 5% [Digikey: 478-3505-1-ND or 712-1322-1-ND] 56 pF 250V 5% C0G RF [Digikey: 490-4867-1-ND] 68 pF 250V RF [Digikey: 490-4868-1-ND] 0805 - 0805 Surface Mount Capacitors 220 pF 250V 2% RF Ceramic Capacitor [Digikey: 712-1398-1-ND] 1000 pF 50V 2% NP0 Ceramic Capacitor [Digikey: 478-3760-1-ND] 0.1 µF 25V 10% Ceramic Capacitor [Digikey: PCC1828TR-ND] 1.0 µF 16V 10% Ceramic Capacitor[Digikey: 490-1691-2-ND] 10.0 µF 10V 10% Ceramic Capacitor[Digikey: 709-1228-1-ND] 10.0 uF 16V 10% Ceramic Capacitor [Digikey: 478-5165-2-ND] 47 uF 6.3V 20% Ceramic Capacitor [Digikey: 587-1779-1-ND or 399-5506-1-ND] 1206 - 1206 Surface Mount Capacitors 47uF 10V 20% Ceramic Capacitor [Digikey: 490-5528-1-ND or 399-5508-1-ND or 445-6010-1-ND] 100uF 6.3V -20%, +80% Y5V Ceramic Capacitor (Digikey: 490-4512-1-ND, Mouser: 81-GRM31CF50J107ZE1L); PARTNO: CGA3E3X7S2A104M080AB,TDK,,810-CGA3E3X7S2A104AB,Multilayer Ceramic Capacitors MLCC - SMD/SMT .1UF 100V 20% 0603, REF7
C26 C27 = microbuilder:CAP_CERAMIC: Ceramic Capacitors 0402 - 0402 Surface Mount Capacitors 16pF 50V 5% [Digikey: 445-4899-2-ND] 18pF 50V 5% [Digikey: 490-1281-2-ND] 22pF 50V 5% [Digikey: 490-1283-2-ND] 68pF 50V 5% [Digikey: 490-1289-2-ND] 0.1uF 10V 10% [Digikey: 490-1318-2-ND] 1.0uF 6.3V 10% [Digikey: 490-1320-2-ND] 0603 - 0603 Surface Mount Capacitors 16 pF 50V 5% [Digikey: 445-5051-2-ND] 22 pF 50V [Digikey: PCC220ACVTR-ND] 33 pF 50V 5% [Digikey: 490-1415-1-ND] 56pF 50V 5% [Digikey: 490-1421-1-ND] 220pF 50V 5% [Digikey: 445-1285-1-ND] 680 pF 50V 2200 pF 50V 5% C0G [Digikey: 445-1297-1-ND] 5600 pF 100V 5% X7R [Digikey: 478-3711-1-ND] 0.1 µF 25V 10% [Digikey: PCC2277TR-ND] 0.22 µF 16V 10% X7R [Digikey: 445-1318-1-ND] 1.0 µF 25V 10% [Digikey: 445-5146-2-ND] 0603 - RF Specific 3pF 250V +/-0.1pF RF [Digikey: 712-1347-1-ND] 18 pF 250V 5% [Digikey: 478-3505-1-ND or 712-1322-1-ND] 56 pF 250V 5% C0G RF [Digikey: 490-4867-1-ND] 68 pF 250V RF [Digikey: 490-4868-1-ND] 0805 - 0805 Surface Mount Capacitors 220 pF 250V 2% RF Ceramic Capacitor [Digikey: 712-1398-1-ND] 1000 pF 50V 2% NP0 Ceramic Capacitor [Digikey: 478-3760-1-ND] 0.1 µF 25V 10% Ceramic Capacitor [Digikey: PCC1828TR-ND] 1.0 µF 16V 10% Ceramic Capacitor[Digikey: 490-1691-2-ND] 10.0 µF 10V 10% Ceramic Capacitor[Digikey: 709-1228-1-ND] 10.0 uF 16V 10% Ceramic Capacitor [Digikey: 478-5165-2-ND] 47 uF 6.3V 20% Ceramic Capacitor [Digikey: 587-1779-1-ND or 399-5506-1-ND] 1206 - 1206 Surface Mount Capacitors 47uF 10V 20% Ceramic Capacitor [Digikey: 490-5528-1-ND or 399-5508-1-ND or 445-6010-1-ND] 100uF 6.3V -20%, +80% Y5V Ceramic Capacitor (Digikey: 490-4512-1-ND, Mouser: 81-GRM31CF50J107ZE1L); PARTNO: VJ0603A180JXACW1BC,Vishay / Vitramon,,77-VJ0603A180JXACBC,Multilayer Ceramic Capacitors MLCC - SMD/SMT 0603 18pF 50volts C0G 5%, REF30
D1 D2 = microbuilder:DIODE: Diode SMA Model Volts Amps Type Vf Vr Digikey # Notes SSA34-E3 40V 3A Schottky 480mV @ 3A 200uA @ 40V SSA34-E3/61TGITR-ND CDBA120-G 20V 1A Schottky 500mV @ 1A 500uA @ 20V 641-1014-6-ND REEL MBRA210 10V 2A Schottky 350mV @ 2A 700uA @ 10V MBRA210LT3 SOD-123 Model Volts Amps Type Vf Vr Order # Notes BAT54T1G 30V 200mA Schottky 800mV @ 200mA 2uA @ 25V BAT54T1GOSTR-ND B0530W 30V 500mA Schottky 430mV @ 500mA 130uA @ 30V B0530W-FDICT-ND REEL MBR120 1A 20V Schottky 340mV @ 1A MBR120VLSFT1GOSCT-ND SOD-323 Model Volts Amps Type Vf Vr Order # Notes PMEG2005EJ 20V 500mA Schottky 355mV @ 500mA 568-4110-1-ND ZLLS410 10V 570mA Schottky 380mV @ 570mA ZLLS410CT-ND 1N4148WS 75V 150mA Silicon/Simple 1V 1N4148WSFSCT-ND REEL SOD-523 Model Volts Amps Type Vf Vr Order # Notes BAT54XV2 30V 200mA Schottky 0.8V @ 100mA BAT54XV2CT-ND TB751S 30V 30mA Schottky RB751S-40TE61CT-ND SOT23-R/W (R = Solder Paste/Reflow Ovens, W = Hand-Soldering) Model Volts Amps Type Vf Vr Order # Notes BAT54FILM 40V 300mA Schottky 497-7162-1-ND; PARTNO: 1N4148WSFL-G3-08,Vishay Semiconductors,,78-1N4148WSFL-G3-08,"Diodes - General Purpose, Power, Switching 100volt 350mA 4ns", REF22
FB1 = microbuilder:FERRITE: Ferrite Bead 0603 MMZ1608B121C - 120 Ohm @ 100MHz, 600mA, 0.15 Ohm DC Resistance - Digikey: 445-2164-1-ND BK1608HW121-T - 120 Ohm, 600mA Ferrite Chip - Digikey: 587-1876-2-ND 0805 HZ0805B272R-10 - 2.7K Ohm @ 100MHz, 200mA, 0.8 Ohm DC Resistance - Digikey: 240-2504-1-ND (see also Murata BLM21BD272SN1L) MMZ2012Y152B - 1.5K Ohm @ 100MHz, 500mA, 0.4 Ohm DC Resistance - Digikey: 445-1560-1-ND - Mainly for high frequency (80-400MHz) MMZ2012R102A - 1K Ohm @ 100MHz, 500mA, 0.3 Ohm DC Resistance - Digikey: 445-1555-2-ND - More general purpose (10-200MHz); PARTNO: HZ0805E601R-10,Laird Technologies,,875-HZ0805E601R-10,"EMI Filter Beads, Chips & Arrays 600ohms 100MHz .5A Monolithic 0805 SMD",0805 REF1
FLASH1 = vovtech:FLASH-SPI
H1-H4 = holes:MOUNT-HOLE: MOUNTING HOLE with drill center marker
IC1 IC2 = 6n138:6N138: MOTOROLA OPTO COUPLER; PARTNO: 6N138S-TA1,Lite-On,,859-6N138STA1,High Speed Optocouplers Darlington 100KBd Transistor Output, REF27
IC5 = 74xx-eu:74*595: 8-bit SHIFT REGISTER, output latch; PARTNO: 74HC595D,NXP Semiconductors,,771-74HC595D-T,Counter Shift Registers 8-BIT SHIFT REG W/OUTPUT LATCH, REF12
JP2 = microbuilder:JUMPER3: JUMPER - 3 Pins; PARTNO: 4-103327-5,TE Connectivity / AMP,,571-4-103327-5,3 pin header 1 row, REF3
JTAG = microbuilder:HEADER-1X6: PIN HEADER; PARTNO: XG8V-0641,Omron Electronics,,653-XG8V-0641,6 pin header 1 row, REF2
LCD1 = NHD-C0220AA-FSW-FTW:NHD-C0220AA-FSW-FTW: NHD-C0220AA-FSW-FTW http://www.newhavendisplay.com/specs/NHD-C0220AA-FSW-FTW.pdf COG (Chip-on-Glass) Liquid Crystal Display Module NHD Newhaven Display C0220 COG, 2 lines x 20 characters AA Model F Transflective SW Side White LED backlight F FSTN+ T 12:00 View Angle W Wide Temp (‐20°C ~ +70°C) RoHS Compliant www.newhavendisplay.com; PARTNO: NHD-C0220AA-FSW-FTW,Newhaven Display,,763-C0220AA-FSW-FTW,LCD Character Display Modules & Accessories COG FSTN(+) 2x20 White Transflective, REF19
LCD_POT1 LCD_POT2 = BaseApp:TRIMPOT: Digikey No. :- __987-1086-ND__; PARTNO: 67WR10KLF,BI Technologies / TT Electronics,,858-67WR10KLF,"Trimmer Resistors - Through Hole 3/8"" Squ 10K 10%", REF28
LED1 LED2 LED_PWR = microbuilder:LED: LED 0603 - 0603 Surface Mount Package 2mA: Green LED - Low Power (3.9mcd, 2ma, 1.7Vf) - Digikey: 475-2709-2-ND Orange LED - Low Power (9.8mcd, 2ma, 1.8Vf) - Digikey: 475-1194-2-ND Red LED - Low Power (5mcd, 2ma, 1.8Vf) - Digikey: 475-1195-2-ND Yellow LED - Low Power (7mcd, 2ma, 1.8Vf) - Digikey: 475-1196-2-ND 5mA: Blue LED - Low Power (17mcd, 5ma, 2.9Vf) - Digikey: LNJ937W8CRACT-ND 0805 - 0805 Surface Mount Package 2mA: Red LED (8.8mcd, 2mA, 1.8Vf, Clear) - Low Power [Digikey: 475-2510-1-ND] Green LED (5mcd, 2mA, 1.8Vf, Clear) - Low Power [Digikey: 475-2730-1-ND] Yellow LED (11.3mcd, 2mA, 1.8Vf, Clear) - Low Power [Digikey: 475-2555-1-ND] 20mA: Red LED (104mcd, 20mA, Diffused) - LS R976 [Digikey: 475-1278-6-ND] Red LED (12mcd, 20mA, 2.0Vf, Clear) - APT2012EC [Digikey: 754-1128-1-ND] Green LED (15mcd, 20mA, 2.2Vf, Clear) - APT2012GC [Digikey: 754-1131-1-ND] Orange LED (160mcd, 20mA, 2.1Vf, Clear) - APT2012SECK [Digikey: 754-1130-1-ND] 1206 - 1206 Surface Mount Package Green LED (26mcd, 20mA, Diffused) - LG N971 [Digikey: 475-1407-6-ND] Red LED (15mcd, 20mA, Diffused) - LH N974 [Digikey: 475-1416-6-ND]; PARTNO: VLMS1300-GS08,Vishay Semiconductors,,78-VLMS1300-GS08,Standard LEDs - SMD Super Red Clear Non-Diff, REF34
MIDI_IN1 MIDI_IN2 MIDI_OUT1 MIDI_OUT2 = keves:MIDIJACK: DIN 5 jack also known as MIDI jack A modification of conn-hirshman:MAB5SH with two options for the grounding 'teeth'; PARTNO: 57PC5F,Switchcraft,,502-57PC5F,DIN Connectors 5 COND 180 DIN CONN, REF37
PRTR5V0U2X1 = keves:USB-ESD-PROTECTOR: USB ESD Protector; PARTNO: PRTR5V0U2X,215",NXP Semiconductors,,771-PRTR5V0U2X-T/R,ESD Suppressors 5.5V DUAL R-R ESD ULTRA LOW CAP, REF20
Q1 = transistor-small-signal:BC337: NPN TRANSISTOR; PARTNO: BC337-16 A1,Taiwan ,,821-BC337-16-A1,Bipolar Transistors - BJT NPN Transistor, REF16
R1 = microbuilder:RESISTOR: Resistors 0402 - 0402 Surface Mount Package 22 Ohm 1% 1/16W [Digikey: 311-22.0LRTR-ND] 33 Ohm 5% 1/16W 1.0K 5% 1/16W 1.5K 5% 1/16W 2.0K 1% 1/16W 10.0K 1% 1/16W [Digikey: 311-10.0KLRTR-ND] 10.0K 5% 1/16W [Digikey: RMCF0402JT10K0TR-ND] 12.1K 1% 1/16W [Digikey: 311-22.0LRTR-ND] 100.0K 5% 1/16W 0603 - 0603 Surface Mount Package 0 Ohm 1/10 Watt 1% Resistor 15 Ohm 1/10 Watt 1% Resistor 33 Ohm 1/10 Watt 1% Resistor 49.9 Ohm 1/10 Watt 1% Resistor 100 Ohm 1/10 Watt 1% Resistor 150 Ohm 1/10 Watt 1% Resistor 240 Ohm 1/10 Watt 1% Resistor 390 Ohm 1/10 Watt 1% Resistor 560 Ohm 1/10 Watt 1% Resistor 680 Ohm 1/10 Watt 1% Resistor 750 Ohm 1/10 Watt 1% Resistor 1.0K Ohm 1/10 Watt 1% Resistor 1.5K Ohm 1/10 Watt 1% Resistor 2.0K Ohm 1/10 Watt 1% Resistor 2.2K Ohm 1/10 Watt 1% Resistor 3.3K Ohm 1/10 Watt 1% Resistor 4.7K Ohm 1/10 Watt 1% Resistor 10.0K Ohm 1/10 Watt 1% Resistor 12.0K Ohm 1/10 Watt 1% Resistor 12.1K Ohm 1/10 Watt 1% Resistor 20.0K Ohm 1/10 Watt 1% Resistor 33.0K Ohm 1/10 Watt 1% Resistor 100.0K Ohm 1/10 Watt 1% Resistor 0805 - 0805 Surface Mount Package 0 Ohm 1/8 Watt 1% Resistor 33 Ohm 1/8 Watt 1% Resistor 100 Ohm 1/8 Watt 1% Resistor 150 Ohm 1/8 Watt 1% Resistor 200 Ohm 1/8 Watt 1% Resistor 240 Ohm 1/8 Watt 1% Resistor 330 Ohm 1/8 Watt 1% Resistor 390 Ohm 1/8 Watt 1% Resistor 470 Ohm 1/8 Watt 1% Resistor 1.0K Ohm 1/8 Watt 1% Resistor 1.5K Ohm 1/8 Watt 1% Resistor 2.0K Ohm 1/8 Watt 1% Resistor 4.7K Ohm 1/8 Watt 1% Resistor 5.1K Ohm 1/8 Watt 1% Resistor 5.6K Ohm 1/8 Watt 1% Resistor 10.0K Ohm 1/8 Watt 1% Resistor 22.0K Ohm 1/8 Watt 1% Resistor 33.0K Ohm 1/8 Watt 1% Resistor 100K Ohm 1/8 Watt 1% Resistor 1206 - 1206 Surface Mount Package 2012 - 2010 Surface Mount Package 0.11 Ohm 1/2 Watt 1% Resistor - Digikey: RHM.11UCT-ND; PARTNO: CRCW060347R0FKEA,Vishay / Dale,,71-CRCW0603-47-E3,Thick Film Resistors - SMD 1/10watt 47ohms 1%, REF11
R2 = microbuilder:RESISTOR: Resistors 0402 - 0402 Surface Mount Package 22 Ohm 1% 1/16W [Digikey: 311-22.0LRTR-ND] 33 Ohm 5% 1/16W 1.0K 5% 1/16W 1.5K 5% 1/16W 2.0K 1% 1/16W 10.0K 1% 1/16W [Digikey: 311-10.0KLRTR-ND] 10.0K 5% 1/16W [Digikey: RMCF0402JT10K0TR-ND] 12.1K 1% 1/16W [Digikey: 311-22.0LRTR-ND] 100.0K 5% 1/16W 0603 - 0603 Surface Mount Package 0 Ohm 1/10 Watt 1% Resistor 15 Ohm 1/10 Watt 1% Resistor 33 Ohm 1/10 Watt 1% Resistor 49.9 Ohm 1/10 Watt 1% Resistor 100 Ohm 1/10 Watt 1% Resistor 150 Ohm 1/10 Watt 1% Resistor 240 Ohm 1/10 Watt 1% Resistor 390 Ohm 1/10 Watt 1% Resistor 560 Ohm 1/10 Watt 1% Resistor 680 Ohm 1/10 Watt 1% Resistor 750 Ohm 1/10 Watt 1% Resistor 1.0K Ohm 1/10 Watt 1% Resistor 1.5K Ohm 1/10 Watt 1% Resistor 2.0K Ohm 1/10 Watt 1% Resistor 2.2K Ohm 1/10 Watt 1% Resistor 3.3K Ohm 1/10 Watt 1% Resistor 4.7K Ohm 1/10 Watt 1% Resistor 10.0K Ohm 1/10 Watt 1% Resistor 12.0K Ohm 1/10 Watt 1% Resistor 12.1K Ohm 1/10 Watt 1% Resistor 20.0K Ohm 1/10 Watt 1% Resistor 33.0K Ohm 1/10 Watt 1% Resistor 100.0K Ohm 1/10 Watt 1% Resistor 0805 - 0805 Surface Mount Package 0 Ohm 1/8 Watt 1% Resistor 33 Ohm 1/8 Watt 1% Resistor 100 Ohm 1/8 Watt 1% Resistor 150 Ohm 1/8 Watt 1% Resistor 200 Ohm 1/8 Watt 1% Resistor 240 Ohm 1/8 Watt 1% Resistor 330 Ohm 1/8 Watt 1% Resistor 390 Ohm 1/8 Watt 1% Resistor 470 Ohm 1/8 Watt 1% Resistor 1.0K Ohm 1/8 Watt 1% Resistor 1.5K Ohm 1/8 Watt 1% Resistor 2.0K Ohm 1/8 Watt 1% Resistor 4.7K Ohm 1/8 Watt 1% Resistor 5.1K Ohm 1/8 Watt 1% Resistor 5.6K Ohm 1/8 Watt 1% Resistor 10.0K Ohm 1/8 Watt 1% Resistor 22.0K Ohm 1/8 Watt 1% Resistor 33.0K Ohm 1/8 Watt 1% Resistor 100K Ohm 1/8 Watt 1% Resistor 1206 - 1206 Surface Mount Package 2012 - 2010 Surface Mount Package 0.11 Ohm 1/2 Watt 1% Resistor - Digikey: RHM.11UCT-ND; PARTNO: RT0603FRE07510RL,Yageo,,603-RT0603FRE07510RL,Thin Film Resistors - SMD 1/10W 510 ohm 1% 50ppm, REF15
R3 R10 R11 = microbuilder:RESISTOR: Resistors 0402 - 0402 Surface Mount Package 22 Ohm 1% 1/16W [Digikey: 311-22.0LRTR-ND] 33 Ohm 5% 1/16W 1.0K 5% 1/16W 1.5K 5% 1/16W 2.0K 1% 1/16W 10.0K 1% 1/16W [Digikey: 311-10.0KLRTR-ND] 10.0K 5% 1/16W [Digikey: RMCF0402JT10K0TR-ND] 12.1K 1% 1/16W [Digikey: 311-22.0LRTR-ND] 100.0K 5% 1/16W 0603 - 0603 Surface Mount Package 0 Ohm 1/10 Watt 1% Resistor 15 Ohm 1/10 Watt 1% Resistor 33 Ohm 1/10 Watt 1% Resistor 49.9 Ohm 1/10 Watt 1% Resistor 100 Ohm 1/10 Watt 1% Resistor 150 Ohm 1/10 Watt 1% Resistor 240 Ohm 1/10 Watt 1% Resistor 390 Ohm 1/10 Watt 1% Resistor 560 Ohm 1/10 Watt 1% Resistor 680 Ohm 1/10 Watt 1% Resistor 750 Ohm 1/10 Watt 1% Resistor 1.0K Ohm 1/10 Watt 1% Resistor 1.5K Ohm 1/10 Watt 1% Resistor 2.0K Ohm 1/10 Watt 1% Resistor 2.2K Ohm 1/10 Watt 1% Resistor 3.3K Ohm 1/10 Watt 1% Resistor 4.7K Ohm 1/10 Watt 1% Resistor 10.0K Ohm 1/10 Watt 1% Resistor 12.0K Ohm 1/10 Watt 1% Resistor 12.1K Ohm 1/10 Watt 1% Resistor 20.0K Ohm 1/10 Watt 1% Resistor 33.0K Ohm 1/10 Watt 1% Resistor 100.0K Ohm 1/10 Watt 1% Resistor 0805 - 0805 Surface Mount Package 0 Ohm 1/8 Watt 1% Resistor 33 Ohm 1/8 Watt 1% Resistor 100 Ohm 1/8 Watt 1% Resistor 150 Ohm 1/8 Watt 1% Resistor 200 Ohm 1/8 Watt 1% Resistor 240 Ohm 1/8 Watt 1% Resistor 330 Ohm 1/8 Watt 1% Resistor 390 Ohm 1/8 Watt 1% Resistor 470 Ohm 1/8 Watt 1% Resistor 1.0K Ohm 1/8 Watt 1% Resistor 1.5K Ohm 1/8 Watt 1% Resistor 2.0K Ohm 1/8 Watt 1% Resistor 4.7K Ohm 1/8 Watt 1% Resistor 5.1K Ohm 1/8 Watt 1% Resistor 5.6K Ohm 1/8 Watt 1% Resistor 10.0K Ohm 1/8 Watt 1% Resistor 22.0K Ohm 1/8 Watt 1% Resistor 33.0K Ohm 1/8 Watt 1% Resistor 100K Ohm 1/8 Watt 1% Resistor 1206 - 1206 Surface Mount Package 2012 - 2010 Surface Mount Package 0.11 Ohm 1/2 Watt 1% Resistor - Digikey: RHM.11UCT-ND; PARTNO: MCT06030C6800FP500,Vishay / Beyschlag,,594-MCT06030C6800FP5,Thin Film Resistors - SMD .1W 680ohm 1% 0603 50ppm Auto, REF36
R4 R12 R14-R16 R46 = microbuilder:RESISTOR: Resistors 0402 - 0402 Surface Mount Package 22 Ohm 1% 1/16W [Digikey: 311-22.0LRTR-ND] 33 Ohm 5% 1/16W 1.0K 5% 1/16W 1.5K 5% 1/16W 2.0K 1% 1/16W 10.0K 1% 1/16W [Digikey: 311-10.0KLRTR-ND] 10.0K 5% 1/16W [Digikey: RMCF0402JT10K0TR-ND] 12.1K 1% 1/16W [Digikey: 311-22.0LRTR-ND] 100.0K 5% 1/16W 0603 - 0603 Surface Mount Package 0 Ohm 1/10 Watt 1% Resistor 15 Ohm 1/10 Watt 1% Resistor 33 Ohm 1/10 Watt 1% Resistor 49.9 Ohm 1/10 Watt 1% Resistor 100 Ohm 1/10 Watt 1% Resistor 150 Ohm 1/10 Watt 1% Resistor 240 Ohm 1/10 Watt 1% Resistor 390 Ohm 1/10 Watt 1% Resistor 560 Ohm 1/10 Watt 1% Resistor 680 Ohm 1/10 Watt 1% Resistor 750 Ohm 1/10 Watt 1% Resistor 1.0K Ohm 1/10 Watt 1% Resistor 1.5K Ohm 1/10 Watt 1% Resistor 2.0K Ohm 1/10 Watt 1% Resistor 2.2K Ohm 1/10 Watt 1% Resistor 3.3K Ohm 1/10 Watt 1% Resistor 4.7K Ohm 1/10 Watt 1% Resistor 10.0K Ohm 1/10 Watt 1% Resistor 12.0K Ohm 1/10 Watt 1% Resistor 12.1K Ohm 1/10 Watt 1% Resistor 20.0K Ohm 1/10 Watt 1% Resistor 33.0K Ohm 1/10 Watt 1% Resistor 100.0K Ohm 1/10 Watt 1% Resistor 0805 - 0805 Surface Mount Package 0 Ohm 1/8 Watt 1% Resistor 33 Ohm 1/8 Watt 1% Resistor 100 Ohm 1/8 Watt 1% Resistor 150 Ohm 1/8 Watt 1% Resistor 200 Ohm 1/8 Watt 1% Resistor 240 Ohm 1/8 Watt 1% Resistor 330 Ohm 1/8 Watt 1% Resistor 390 Ohm 1/8 Watt 1% Resistor 470 Ohm 1/8 Watt 1% Resistor 1.0K Ohm 1/8 Watt 1% Resistor 1.5K Ohm 1/8 Watt 1% Resistor 2.0K Ohm 1/8 Watt 1% Resistor 4.7K Ohm 1/8 Watt 1% Resistor 5.1K Ohm 1/8 Watt 1% Resistor 5.6K Ohm 1/8 Watt 1% Resistor 10.0K Ohm 1/8 Watt 1% Resistor 22.0K Ohm 1/8 Watt 1% Resistor 33.0K Ohm 1/8 Watt 1% Resistor 100K Ohm 1/8 Watt 1% Resistor 1206 - 1206 Surface Mount Package 2012 - 2010 Surface Mount Package 0.11 Ohm 1/2 Watt 1% Resistor - Digikey: RHM.11UCT-ND; PARTNO: MCT06030Z0000ZP500,Vishay / Beyschlag,,594-MCT06030Z0000ZP5,Thin Film Resistors - SMD Zero ohm Jumper, REF40
R5 R18 R34-R38 R44 R45 = microbuilder:RESISTOR: Resistors 0402 - 0402 Surface Mount Package 22 Ohm 1% 1/16W [Digikey: 311-22.0LRTR-ND] 33 Ohm 5% 1/16W 1.0K 5% 1/16W 1.5K 5% 1/16W 2.0K 1% 1/16W 10.0K 1% 1/16W [Digikey: 311-10.0KLRTR-ND] 10.0K 5% 1/16W [Digikey: RMCF0402JT10K0TR-ND] 12.1K 1% 1/16W [Digikey: 311-22.0LRTR-ND] 100.0K 5% 1/16W 0603 - 0603 Surface Mount Package 0 Ohm 1/10 Watt 1% Resistor 15 Ohm 1/10 Watt 1% Resistor 33 Ohm 1/10 Watt 1% Resistor 49.9 Ohm 1/10 Watt 1% Resistor 100 Ohm 1/10 Watt 1% Resistor 150 Ohm 1/10 Watt 1% Resistor 240 Ohm 1/10 Watt 1% Resistor 390 Ohm 1/10 Watt 1% Resistor 560 Ohm 1/10 Watt 1% Resistor 680 Ohm 1/10 Watt 1% Resistor 750 Ohm 1/10 Watt 1% Resistor 1.0K Ohm 1/10 Watt 1% Resistor 1.5K Ohm 1/10 Watt 1% Resistor 2.0K Ohm 1/10 Watt 1% Resistor 2.2K Ohm 1/10 Watt 1% Resistor 3.3K Ohm 1/10 Watt 1% Resistor 4.7K Ohm 1/10 Watt 1% Resistor 10.0K Ohm 1/10 Watt 1% Resistor 12.0K Ohm 1/10 Watt 1% Resistor 12.1K Ohm 1/10 Watt 1% Resistor 20.0K Ohm 1/10 Watt 1% Resistor 33.0K Ohm 1/10 Watt 1% Resistor 100.0K Ohm 1/10 Watt 1% Resistor 0805 - 0805 Surface Mount Package 0 Ohm 1/8 Watt 1% Resistor 33 Ohm 1/8 Watt 1% Resistor 100 Ohm 1/8 Watt 1% Resistor 150 Ohm 1/8 Watt 1% Resistor 200 Ohm 1/8 Watt 1% Resistor 240 Ohm 1/8 Watt 1% Resistor 330 Ohm 1/8 Watt 1% Resistor 390 Ohm 1/8 Watt 1% Resistor 470 Ohm 1/8 Watt 1% Resistor 1.0K Ohm 1/8 Watt 1% Resistor 1.5K Ohm 1/8 Watt 1% Resistor 2.0K Ohm 1/8 Watt 1% Resistor 4.7K Ohm 1/8 Watt 1% Resistor 5.1K Ohm 1/8 Watt 1% Resistor 5.6K Ohm 1/8 Watt 1% Resistor 10.0K Ohm 1/8 Watt 1% Resistor 22.0K Ohm 1/8 Watt 1% Resistor 33.0K Ohm 1/8 Watt 1% Resistor 100K Ohm 1/8 Watt 1% Resistor 1206 - 1206 Surface Mount Package 2012 - 2010 Surface Mount Package 0.11 Ohm 1/2 Watt 1% Resistor - Digikey: RHM.11UCT-ND; PARTNO: CRCW060310K0FKEA,Vishay / Dale,,71-CRCW0603-10K-E3,Thick Film Resistors - SMD 1/10watt 10Kohms 1%, REF35
R6 R7 = microbuilder:RESISTOR: Resistors 0402 - 0402 Surface Mount Package 22 Ohm 1% 1/16W [Digikey: 311-22.0LRTR-ND] 33 Ohm 5% 1/16W 1.0K 5% 1/16W 1.5K 5% 1/16W 2.0K 1% 1/16W 10.0K 1% 1/16W [Digikey: 311-10.0KLRTR-ND] 10.0K 5% 1/16W [Digikey: RMCF0402JT10K0TR-ND] 12.1K 1% 1/16W [Digikey: 311-22.0LRTR-ND] 100.0K 5% 1/16W 0603 - 0603 Surface Mount Package 0 Ohm 1/10 Watt 1% Resistor 15 Ohm 1/10 Watt 1% Resistor 33 Ohm 1/10 Watt 1% Resistor 49.9 Ohm 1/10 Watt 1% Resistor 100 Ohm 1/10 Watt 1% Resistor 150 Ohm 1/10 Watt 1% Resistor 240 Ohm 1/10 Watt 1% Resistor 390 Ohm 1/10 Watt 1% Resistor 560 Ohm 1/10 Watt 1% Resistor 680 Ohm 1/10 Watt 1% Resistor 750 Ohm 1/10 Watt 1% Resistor 1.0K Ohm 1/10 Watt 1% Resistor 1.5K Ohm 1/10 Watt 1% Resistor 2.0K Ohm 1/10 Watt 1% Resistor 2.2K Ohm 1/10 Watt 1% Resistor 3.3K Ohm 1/10 Watt 1% Resistor 4.7K Ohm 1/10 Watt 1% Resistor 10.0K Ohm 1/10 Watt 1% Resistor 12.0K Ohm 1/10 Watt 1% Resistor 12.1K Ohm 1/10 Watt 1% Resistor 20.0K Ohm 1/10 Watt 1% Resistor 33.0K Ohm 1/10 Watt 1% Resistor 100.0K Ohm 1/10 Watt 1% Resistor 0805 - 0805 Surface Mount Package 0 Ohm 1/8 Watt 1% Resistor 33 Ohm 1/8 Watt 1% Resistor 100 Ohm 1/8 Watt 1% Resistor 150 Ohm 1/8 Watt 1% Resistor 200 Ohm 1/8 Watt 1% Resistor 240 Ohm 1/8 Watt 1% Resistor 330 Ohm 1/8 Watt 1% Resistor 390 Ohm 1/8 Watt 1% Resistor 470 Ohm 1/8 Watt 1% Resistor 1.0K Ohm 1/8 Watt 1% Resistor 1.5K Ohm 1/8 Watt 1% Resistor 2.0K Ohm 1/8 Watt 1% Resistor 4.7K Ohm 1/8 Watt 1% Resistor 5.1K Ohm 1/8 Watt 1% Resistor 5.6K Ohm 1/8 Watt 1% Resistor 10.0K Ohm 1/8 Watt 1% Resistor 22.0K Ohm 1/8 Watt 1% Resistor 33.0K Ohm 1/8 Watt 1% Resistor 100K Ohm 1/8 Watt 1% Resistor 1206 - 1206 Surface Mount Package 2012 - 2010 Surface Mount Package 0.11 Ohm 1/2 Watt 1% Resistor - Digikey: RHM.11UCT-ND; PARTNO: MCT06030C2209FP500,Vishay / Beyschlag,,594-MCT06030C2209FP5,Thin Film Resistors - SMD .1W 22ohm 1% 0603 50ppm Auto, REF32
R8 = microbuilder:RESISTOR: Resistors 0402 - 0402 Surface Mount Package 22 Ohm 1% 1/16W [Digikey: 311-22.0LRTR-ND] 33 Ohm 5% 1/16W 1.0K 5% 1/16W 1.5K 5% 1/16W 2.0K 1% 1/16W 10.0K 1% 1/16W [Digikey: 311-10.0KLRTR-ND] 10.0K 5% 1/16W [Digikey: RMCF0402JT10K0TR-ND] 12.1K 1% 1/16W [Digikey: 311-22.0LRTR-ND] 100.0K 5% 1/16W 0603 - 0603 Surface Mount Package 0 Ohm 1/10 Watt 1% Resistor 15 Ohm 1/10 Watt 1% Resistor 33 Ohm 1/10 Watt 1% Resistor 49.9 Ohm 1/10 Watt 1% Resistor 100 Ohm 1/10 Watt 1% Resistor 150 Ohm 1/10 Watt 1% Resistor 240 Ohm 1/10 Watt 1% Resistor 390 Ohm 1/10 Watt 1% Resistor 560 Ohm 1/10 Watt 1% Resistor 680 Ohm 1/10 Watt 1% Resistor 750 Ohm 1/10 Watt 1% Resistor 1.0K Ohm 1/10 Watt 1% Resistor 1.5K Ohm 1/10 Watt 1% Resistor 2.0K Ohm 1/10 Watt 1% Resistor 2.2K Ohm 1/10 Watt 1% Resistor 3.3K Ohm 1/10 Watt 1% Resistor 4.7K Ohm 1/10 Watt 1% Resistor 10.0K Ohm 1/10 Watt 1% Resistor 12.0K Ohm 1/10 Watt 1% Resistor 12.1K Ohm 1/10 Watt 1% Resistor 20.0K Ohm 1/10 Watt 1% Resistor 33.0K Ohm 1/10 Watt 1% Resistor 100.0K Ohm 1/10 Watt 1% Resistor 0805 - 0805 Surface Mount Package 0 Ohm 1/8 Watt 1% Resistor 33 Ohm 1/8 Watt 1% Resistor 100 Ohm 1/8 Watt 1% Resistor 150 Ohm 1/8 Watt 1% Resistor 200 Ohm 1/8 Watt 1% Resistor 240 Ohm 1/8 Watt 1% Resistor 330 Ohm 1/8 Watt 1% Resistor 390 Ohm 1/8 Watt 1% Resistor 470 Ohm 1/8 Watt 1% Resistor 1.0K Ohm 1/8 Watt 1% Resistor 1.5K Ohm 1/8 Watt 1% Resistor 2.0K Ohm 1/8 Watt 1% Resistor 4.7K Ohm 1/8 Watt 1% Resistor 5.1K Ohm 1/8 Watt 1% Resistor 5.6K Ohm 1/8 Watt 1% Resistor 10.0K Ohm 1/8 Watt 1% Resistor 22.0K Ohm 1/8 Watt 1% Resistor 33.0K Ohm 1/8 Watt 1% Resistor 100K Ohm 1/8 Watt 1% Resistor 1206 - 1206 Surface Mount Package 2012 - 2010 Surface Mount Package 0.11 Ohm 1/2 Watt 1% Resistor - Digikey: RHM.11UCT-ND; PARTNO: RT0603FRE07330RL,Yageo,,603-RT0603FRE07330RL,Thin Film Resistors - SMD 1/10W 330 ohm 1% 50ppm, REF14
R9 = microbuilder:RESISTOR: Resistors 0402 - 0402 Surface Mount Package 22 Ohm 1% 1/16W [Digikey: 311-22.0LRTR-ND] 33 Ohm 5% 1/16W 1.0K 5% 1/16W 1.5K 5% 1/16W 2.0K 1% 1/16W 10.0K 1% 1/16W [Digikey: 311-10.0KLRTR-ND] 10.0K 5% 1/16W [Digikey: RMCF0402JT10K0TR-ND] 12.1K 1% 1/16W [Digikey: 311-22.0LRTR-ND] 100.0K 5% 1/16W 0603 - 0603 Surface Mount Package 0 Ohm 1/10 Watt 1% Resistor 15 Ohm 1/10 Watt 1% Resistor 33 Ohm 1/10 Watt 1% Resistor 49.9 Ohm 1/10 Watt 1% Resistor 100 Ohm 1/10 Watt 1% Resistor 150 Ohm 1/10 Watt 1% Resistor 240 Ohm 1/10 Watt 1% Resistor 390 Ohm 1/10 Watt 1% Resistor 560 Ohm 1/10 Watt 1% Resistor 680 Ohm 1/10 Watt 1% Resistor 750 Ohm 1/10 Watt 1% Resistor 1.0K Ohm 1/10 Watt 1% Resistor 1.5K Ohm 1/10 Watt 1% Resistor 2.0K Ohm 1/10 Watt 1% Resistor 2.2K Ohm 1/10 Watt 1% Resistor 3.3K Ohm 1/10 Watt 1% Resistor 4.7K Ohm 1/10 Watt 1% Resistor 10.0K Ohm 1/10 Watt 1% Resistor 12.0K Ohm 1/10 Watt 1% Resistor 12.1K Ohm 1/10 Watt 1% Resistor 20.0K Ohm 1/10 Watt 1% Resistor 33.0K Ohm 1/10 Watt 1% Resistor 100.0K Ohm 1/10 Watt 1% Resistor 0805 - 0805 Surface Mount Package 0 Ohm 1/8 Watt 1% Resistor 33 Ohm 1/8 Watt 1% Resistor 100 Ohm 1/8 Watt 1% Resistor 150 Ohm 1/8 Watt 1% Resistor 200 Ohm 1/8 Watt 1% Resistor 240 Ohm 1/8 Watt 1% Resistor 330 Ohm 1/8 Watt 1% Resistor 390 Ohm 1/8 Watt 1% Resistor 470 Ohm 1/8 Watt 1% Resistor 1.0K Ohm 1/8 Watt 1% Resistor 1.5K Ohm 1/8 Watt 1% Resistor 2.0K Ohm 1/8 Watt 1% Resistor 4.7K Ohm 1/8 Watt 1% Resistor 5.1K Ohm 1/8 Watt 1% Resistor 5.6K Ohm 1/8 Watt 1% Resistor 10.0K Ohm 1/8 Watt 1% Resistor 22.0K Ohm 1/8 Watt 1% Resistor 33.0K Ohm 1/8 Watt 1% Resistor 100K Ohm 1/8 Watt 1% Resistor 1206 - 1206 Surface Mount Package 2012 - 2010 Surface Mount Package 0.11 Ohm 1/2 Watt 1% Resistor - Digikey: RHM.11UCT-ND; PARTNO: RT0603FRE07220KL,Yageo,,603-RT0603FRE07220KL,Thin Film Resistors - SMD 1/10W 220K ohm 1% 50ppm, REF13
R13 R17 = microbuilder:RESISTOR: Resistors 0402 - 0402 Surface Mount Package 22 Ohm 1% 1/16W [Digikey: 311-22.0LRTR-ND] 33 Ohm 5% 1/16W 1.0K 5% 1/16W 1.5K 5% 1/16W 2.0K 1% 1/16W 10.0K 1% 1/16W [Digikey: 311-10.0KLRTR-ND] 10.0K 5% 1/16W [Digikey: RMCF0402JT10K0TR-ND] 12.1K 1% 1/16W [Digikey: 311-22.0LRTR-ND] 100.0K 5% 1/16W 0603 - 0603 Surface Mount Package 0 Ohm 1/10 Watt 1% Resistor 15 Ohm 1/10 Watt 1% Resistor 33 Ohm 1/10 Watt 1% Resistor 49.9 Ohm 1/10 Watt 1% Resistor 100 Ohm 1/10 Watt 1% Resistor 150 Ohm 1/10 Watt 1% Resistor 240 Ohm 1/10 Watt 1% Resistor 390 Ohm 1/10 Watt 1% Resistor 560 Ohm 1/10 Watt 1% Resistor 680 Ohm 1/10 Watt 1% Resistor 750 Ohm 1/10 Watt 1% Resistor 1.0K Ohm 1/10 Watt 1% Resistor 1.5K Ohm 1/10 Watt 1% Resistor 2.0K Ohm 1/10 Watt 1% Resistor 2.2K Ohm 1/10 Watt 1% Resistor 3.3K Ohm 1/10 Watt 1% Resistor 4.7K Ohm 1/10 Watt 1% Resistor 10.0K Ohm 1/10 Watt 1% Resistor 12.0K Ohm 1/10 Watt 1% Resistor 12.1K Ohm 1/10 Watt 1% Resistor 20.0K Ohm 1/10 Watt 1% Resistor 33.0K Ohm 1/10 Watt 1% Resistor 100.0K Ohm 1/10 Watt 1% Resistor 0805 - 0805 Surface Mount Package 0 Ohm 1/8 Watt 1% Resistor 33 Ohm 1/8 Watt 1% Resistor 100 Ohm 1/8 Watt 1% Resistor 150 Ohm 1/8 Watt 1% Resistor 200 Ohm 1/8 Watt 1% Resistor 240 Ohm 1/8 Watt 1% Resistor 330 Ohm 1/8 Watt 1% Resistor 390 Ohm 1/8 Watt 1% Resistor 470 Ohm 1/8 Watt 1% Resistor 1.0K Ohm 1/8 Watt 1% Resistor 1.5K Ohm 1/8 Watt 1% Resistor 2.0K Ohm 1/8 Watt 1% Resistor 4.7K Ohm 1/8 Watt 1% Resistor 5.1K Ohm 1/8 Watt 1% Resistor 5.6K Ohm 1/8 Watt 1% Resistor 10.0K Ohm 1/8 Watt 1% Resistor 22.0K Ohm 1/8 Watt 1% Resistor 33.0K Ohm 1/8 Watt 1% Resistor 100K Ohm 1/8 Watt 1% Resistor 1206 - 1206 Surface Mount Package 2012 - 2010 Surface Mount Package 0.11 Ohm 1/2 Watt 1% Resistor - Digikey: RHM.11UCT-ND; PARTNO: MCT06030C2201FP500,Vishay / Beyschlag,,594-MCT06030C2201FP5,Thin Film Resistors - SMD .1W 2.2Kohm 1% 0603 50ppm Auto, REF24
R19-R22 R28 R33 = microbuilder:RESISTOR: Resistors 0402 - 0402 Surface Mount Package 22 Ohm 1% 1/16W [Digikey: 311-22.0LRTR-ND] 33 Ohm 5% 1/16W 1.0K 5% 1/16W 1.5K 5% 1/16W 2.0K 1% 1/16W 10.0K 1% 1/16W [Digikey: 311-10.0KLRTR-ND] 10.0K 5% 1/16W [Digikey: RMCF0402JT10K0TR-ND] 12.1K 1% 1/16W [Digikey: 311-22.0LRTR-ND] 100.0K 5% 1/16W 0603 - 0603 Surface Mount Package 0 Ohm 1/10 Watt 1% Resistor 15 Ohm 1/10 Watt 1% Resistor 33 Ohm 1/10 Watt 1% Resistor 49.9 Ohm 1/10 Watt 1% Resistor 100 Ohm 1/10 Watt 1% Resistor 150 Ohm 1/10 Watt 1% Resistor 240 Ohm 1/10 Watt 1% Resistor 390 Ohm 1/10 Watt 1% Resistor 560 Ohm 1/10 Watt 1% Resistor 680 Ohm 1/10 Watt 1% Resistor 750 Ohm 1/10 Watt 1% Resistor 1.0K Ohm 1/10 Watt 1% Resistor 1.5K Ohm 1/10 Watt 1% Resistor 2.0K Ohm 1/10 Watt 1% Resistor 2.2K Ohm 1/10 Watt 1% Resistor 3.3K Ohm 1/10 Watt 1% Resistor 4.7K Ohm 1/10 Watt 1% Resistor 10.0K Ohm 1/10 Watt 1% Resistor 12.0K Ohm 1/10 Watt 1% Resistor 12.1K Ohm 1/10 Watt 1% Resistor 20.0K Ohm 1/10 Watt 1% Resistor 33.0K Ohm 1/10 Watt 1% Resistor 100.0K Ohm 1/10 Watt 1% Resistor 0805 - 0805 Surface Mount Package 0 Ohm 1/8 Watt 1% Resistor 33 Ohm 1/8 Watt 1% Resistor 100 Ohm 1/8 Watt 1% Resistor 150 Ohm 1/8 Watt 1% Resistor 200 Ohm 1/8 Watt 1% Resistor 240 Ohm 1/8 Watt 1% Resistor 330 Ohm 1/8 Watt 1% Resistor 390 Ohm 1/8 Watt 1% Resistor 470 Ohm 1/8 Watt 1% Resistor 1.0K Ohm 1/8 Watt 1% Resistor 1.5K Ohm 1/8 Watt 1% Resistor 2.0K Ohm 1/8 Watt 1% Resistor 4.7K Ohm 1/8 Watt 1% Resistor 5.1K Ohm 1/8 Watt 1% Resistor 5.6K Ohm 1/8 Watt 1% Resistor 10.0K Ohm 1/8 Watt 1% Resistor 22.0K Ohm 1/8 Watt 1% Resistor 33.0K Ohm 1/8 Watt 1% Resistor 100K Ohm 1/8 Watt 1% Resistor 1206 - 1206 Surface Mount Package 2012 - 2010 Surface Mount Package 0.11 Ohm 1/2 Watt 1% Resistor - Digikey: RHM.11UCT-ND; PARTNO: CRCW06031K00FKEA,Vishay / Dale,,71-CRCW0603-1.0K-E3,Thick Film Resistors - SMD 1/10watt 1.0Kohms 1%, REF41
R23 = microbuilder:RESISTOR: Resistors 0402 - 0402 Surface Mount Package 22 Ohm 1% 1/16W [Digikey: 311-22.0LRTR-ND] 33 Ohm 5% 1/16W 1.0K 5% 1/16W 1.5K 5% 1/16W 2.0K 1% 1/16W 10.0K 1% 1/16W [Digikey: 311-10.0KLRTR-ND] 10.0K 5% 1/16W [Digikey: RMCF0402JT10K0TR-ND] 12.1K 1% 1/16W [Digikey: 311-22.0LRTR-ND] 100.0K 5% 1/16W 0603 - 0603 Surface Mount Package 0 Ohm 1/10 Watt 1% Resistor 15 Ohm 1/10 Watt 1% Resistor 33 Ohm 1/10 Watt 1% Resistor 49.9 Ohm 1/10 Watt 1% Resistor 100 Ohm 1/10 Watt 1% Resistor 150 Ohm 1/10 Watt 1% Resistor 240 Ohm 1/10 Watt 1% Resistor 390 Ohm 1/10 Watt 1% Resistor 560 Ohm 1/10 Watt 1% Resistor 680 Ohm 1/10 Watt 1% Resistor 750 Ohm 1/10 Watt 1% Resistor 1.0K Ohm 1/10 Watt 1% Resistor 1.5K Ohm 1/10 Watt 1% Resistor 2.0K Ohm 1/10 Watt 1% Resistor 2.2K Ohm 1/10 Watt 1% Resistor 3.3K Ohm 1/10 Watt 1% Resistor 4.7K Ohm 1/10 Watt 1% Resistor 10.0K Ohm 1/10 Watt 1% Resistor 12.0K Ohm 1/10 Watt 1% Resistor 12.1K Ohm 1/10 Watt 1% Resistor 20.0K Ohm 1/10 Watt 1% Resistor 33.0K Ohm 1/10 Watt 1% Resistor 100.0K Ohm 1/10 Watt 1% Resistor 0805 - 0805 Surface Mount Package 0 Ohm 1/8 Watt 1% Resistor 33 Ohm 1/8 Watt 1% Resistor 100 Ohm 1/8 Watt 1% Resistor 150 Ohm 1/8 Watt 1% Resistor 200 Ohm 1/8 Watt 1% Resistor 240 Ohm 1/8 Watt 1% Resistor 330 Ohm 1/8 Watt 1% Resistor 390 Ohm 1/8 Watt 1% Resistor 470 Ohm 1/8 Watt 1% Resistor 1.0K Ohm 1/8 Watt 1% Resistor 1.5K Ohm 1/8 Watt 1% Resistor 2.0K Ohm 1/8 Watt 1% Resistor 4.7K Ohm 1/8 Watt 1% Resistor 5.1K Ohm 1/8 Watt 1% Resistor 5.6K Ohm 1/8 Watt 1% Resistor 10.0K Ohm 1/8 Watt 1% Resistor 22.0K Ohm 1/8 Watt 1% Resistor 33.0K Ohm 1/8 Watt 1% Resistor 100K Ohm 1/8 Watt 1% Resistor 1206 - 1206 Surface Mount Package 2012 - 2010 Surface Mount Package 0.11 Ohm 1/2 Watt 1% Resistor - Digikey: RHM.11UCT-ND; PARTNO: CRCW06031M00FKEA,Vishay / Dale,,71-CRCW0603-1.0M-E3,Thick Film Resistors - SMD 1/10watt 1.0Mohms 1%, REF8
R24-R26 R29-R31 = microbuilder:RESISTOR: Resistors 0402 - 0402 Surface Mount Package 22 Ohm 1% 1/16W [Digikey: 311-22.0LRTR-ND] 33 Ohm 5% 1/16W 1.0K 5% 1/16W 1.5K 5% 1/16W 2.0K 1% 1/16W 10.0K 1% 1/16W [Digikey: 311-10.0KLRTR-ND] 10.0K 5% 1/16W [Digikey: RMCF0402JT10K0TR-ND] 12.1K 1% 1/16W [Digikey: 311-22.0LRTR-ND] 100.0K 5% 1/16W 0603 - 0603 Surface Mount Package 0 Ohm 1/10 Watt 1% Resistor 15 Ohm 1/10 Watt 1% Resistor 33 Ohm 1/10 Watt 1% Resistor 49.9 Ohm 1/10 Watt 1% Resistor 100 Ohm 1/10 Watt 1% Resistor 150 Ohm 1/10 Watt 1% Resistor 240 Ohm 1/10 Watt 1% Resistor 390 Ohm 1/10 Watt 1% Resistor 560 Ohm 1/10 Watt 1% Resistor 680 Ohm 1/10 Watt 1% Resistor 750 Ohm 1/10 Watt 1% Resistor 1.0K Ohm 1/10 Watt 1% Resistor 1.5K Ohm 1/10 Watt 1% Resistor 2.0K Ohm 1/10 Watt 1% Resistor 2.2K Ohm 1/10 Watt 1% Resistor 3.3K Ohm 1/10 Watt 1% Resistor 4.7K Ohm 1/10 Watt 1% Resistor 10.0K Ohm 1/10 Watt 1% Resistor 12.0K Ohm 1/10 Watt 1% Resistor 12.1K Ohm 1/10 Watt 1% Resistor 20.0K Ohm 1/10 Watt 1% Resistor 33.0K Ohm 1/10 Watt 1% Resistor 100.0K Ohm 1/10 Watt 1% Resistor 0805 - 0805 Surface Mount Package 0 Ohm 1/8 Watt 1% Resistor 33 Ohm 1/8 Watt 1% Resistor 100 Ohm 1/8 Watt 1% Resistor 150 Ohm 1/8 Watt 1% Resistor 200 Ohm 1/8 Watt 1% Resistor 240 Ohm 1/8 Watt 1% Resistor 330 Ohm 1/8 Watt 1% Resistor 390 Ohm 1/8 Watt 1% Resistor 470 Ohm 1/8 Watt 1% Resistor 1.0K Ohm 1/8 Watt 1% Resistor 1.5K Ohm 1/8 Watt 1% Resistor 2.0K Ohm 1/8 Watt 1% Resistor 4.7K Ohm 1/8 Watt 1% Resistor 5.1K Ohm 1/8 Watt 1% Resistor 5.6K Ohm 1/8 Watt 1% Resistor 10.0K Ohm 1/8 Watt 1% Resistor 22.0K Ohm 1/8 Watt 1% Resistor 33.0K Ohm 1/8 Watt 1% Resistor 100K Ohm 1/8 Watt 1% Resistor 1206 - 1206 Surface Mount Package 2012 - 2010 Surface Mount Package 0.11 Ohm 1/2 Watt 1% Resistor - Digikey: RHM.11UCT-ND; PARTNO: MCT06030C2200FP500,Vishay / Beyschlag,,594-MCT06030C2200FP5,Thin Film Resistors - SMD .1W 220ohm 1% 0603 50ppm Auto, REF43
R27 R32 = microbuilder:RESISTOR: Resistors 0402 - 0402 Surface Mount Package 22 Ohm 1% 1/16W [Digikey: 311-22.0LRTR-ND] 33 Ohm 5% 1/16W 1.0K 5% 1/16W 1.5K 5% 1/16W 2.0K 1% 1/16W 10.0K 1% 1/16W [Digikey: 311-10.0KLRTR-ND] 10.0K 5% 1/16W [Digikey: RMCF0402JT10K0TR-ND] 12.1K 1% 1/16W [Digikey: 311-22.0LRTR-ND] 100.0K 5% 1/16W 0603 - 0603 Surface Mount Package 0 Ohm 1/10 Watt 1% Resistor 15 Ohm 1/10 Watt 1% Resistor 33 Ohm 1/10 Watt 1% Resistor 49.9 Ohm 1/10 Watt 1% Resistor 100 Ohm 1/10 Watt 1% Resistor 150 Ohm 1/10 Watt 1% Resistor 240 Ohm 1/10 Watt 1% Resistor 390 Ohm 1/10 Watt 1% Resistor 560 Ohm 1/10 Watt 1% Resistor 680 Ohm 1/10 Watt 1% Resistor 750 Ohm 1/10 Watt 1% Resistor 1.0K Ohm 1/10 Watt 1% Resistor 1.5K Ohm 1/10 Watt 1% Resistor 2.0K Ohm 1/10 Watt 1% Resistor 2.2K Ohm 1/10 Watt 1% Resistor 3.3K Ohm 1/10 Watt 1% Resistor 4.7K Ohm 1/10 Watt 1% Resistor 10.0K Ohm 1/10 Watt 1% Resistor 12.0K Ohm 1/10 Watt 1% Resistor 12.1K Ohm 1/10 Watt 1% Resistor 20.0K Ohm 1/10 Watt 1% Resistor 33.0K Ohm 1/10 Watt 1% Resistor 100.0K Ohm 1/10 Watt 1% Resistor 0805 - 0805 Surface Mount Package 0 Ohm 1/8 Watt 1% Resistor 33 Ohm 1/8 Watt 1% Resistor 100 Ohm 1/8 Watt 1% Resistor 150 Ohm 1/8 Watt 1% Resistor 200 Ohm 1/8 Watt 1% Resistor 240 Ohm 1/8 Watt 1% Resistor 330 Ohm 1/8 Watt 1% Resistor 390 Ohm 1/8 Watt 1% Resistor 470 Ohm 1/8 Watt 1% Resistor 1.0K Ohm 1/8 Watt 1% Resistor 1.5K Ohm 1/8 Watt 1% Resistor 2.0K Ohm 1/8 Watt 1% Resistor 4.7K Ohm 1/8 Watt 1% Resistor 5.1K Ohm 1/8 Watt 1% Resistor 5.6K Ohm 1/8 Watt 1% Resistor 10.0K Ohm 1/8 Watt 1% Resistor 22.0K Ohm 1/8 Watt 1% Resistor 33.0K Ohm 1/8 Watt 1% Resistor 100K Ohm 1/8 Watt 1% Resistor 1206 - 1206 Surface Mount Package 2012 - 2010 Surface Mount Package 0.11 Ohm 1/2 Watt 1% Resistor - Digikey: RHM.11UCT-ND; PARTNO: MCT06030C4701FP500,Vishay,,594-MCT06030C4701FP5,Thin Film Resistors - SMD .1W 4.7Kohms 1% 0603 50ppm Auto, REF26
R39-R43 = pot-alps:POT_US; PARTNO: RK09D1130C2P,ALPS,,688-RK09D1130C2P,Potentiometers 9MM 10K V/ADJ, REF39
S1-S5 = og-switch:40-XX: OMRON SWITCH; PARTNO: TL1100F160Q,E-Switch,,612-TL1100,Tactile Switches 12X7.3MM 160GF, REF38
SPI_A = pinhead:PINHD-2X6: PIN HEADER; PARTNO: 67996-412HLF,FCI,,649-67996-412HLF,6x2 header pins, REF4
SPI_B = pinhead:PINHD-2X7: PIN HEADER; PARTNO: 67997-414HLF,FCI,,649-67997-414HLF,7x2 header pins, REF5
STM32F407XX1 = BaseApp:STM32F407; PARTNO: STM32F407VGT6,ST,,511-STM32F407VGT6,ARM Microcontrollers - MCU ARM M4 1024 FLASH 168 Mhz 192kB SRAM, REF6
SW1 SW2 = switch-alps:EC12E_SW: ALPS rotary Encoder EC12E series with switch; PARTNO: RK09D1130C2P,ALPS,,688-RK09D1130C2P,Potentiometers 9MM 10K V/ADJ, REF39
SW_RST SW_USER = microbuilder:SWITCH_TACT_SMT: SMT Tact Switches 6x6mm - Digikey: P12940SCT-ND KMR2 (4.6x2.8mm) - Digikey: 401-1426-1-ND EVQ-PQHB55 - Light Touch, 160GF (4.5x4.5mm) - Digikey: P8090SCT-ND; PARTNO: EVQ-PQHB55,Panasonic,,667-EVQ-PQHB55,Tactile Switches Super small sized S Light Touch Switch, REF21
U1 = microbuilder:EEPROM_I2C_SOIC8_GENERIC: Note: The same pinout is used for many I2C EEPROMs in SOIC8(150mil) from a variety of manufacturers and in various sizes. Examples: 16K (2K x 8 Bit) I2C EEPROM 1.7-5.5V, 400KHz, -40°C-85°C Digikey: CAT24C16WI-GT3CT-ND 256K (32K x 8 Bit) I2C EEPROM 1.7-5.5V, 400KHz, -40°C-85°C Digikey: 24AA256-I/SN-ND; PARTNO: 24LC512-I/SN,Microchip Technology,,579-24LC512-I/SN,EEPROM 512K 64K X 8 2.5V SER EE IND, REF10
U$14 = SparkFun-Connectors:USB+SHIELD: USB+Shield USB connector with shield pins connectable; PARTNO: 67068-9001,Molex,,538-67068-9001,USB Connectors USB Type B Recept R/A w/ Solder Tabs, REF18
U$25 = keves:MIC37100; PARTNO: MIC37100-3.3WS TR,Micrel,,998-MIC37100-3.3WSTR,LDO Voltage Regulators 1.0A Low Voltage uCap LDO Regulator in SOT223 Pkg(ROHS Compliant), REF17
Y1 = microbuilder:CRYSTAL: Crystals HC49UP - Surface Mount Crystal 4.0MHz 18pF +/-30ppm Surface Mount Crystal [Digikey: 535-9857-1-ND] 12.0 MHz Surface Mount Crystal [Digikey: 535-9869-6-ND] 25.0 MHz Surface Mount Crystal [Digikey: 535-9078-1-ND] 2.5 x 2.0mm - MEMs SMT Crystal 16.0 MHz 10pF 20ppm 2.5 x 2.0mm Crystal [Digikey -40-85°C: 535-10923-1-ND] 3.2 x 2.5mm - MEMs SMT Crystal 12.0 MHz 8pF 15ppm 3.2 x 2.5mm Crystal [Digikey: -10-70°C: 644-1047-1-ND -40-125°C: 644-1128-1-ND] 16.0 MHz 8pF 15ppm 3.2 x 2.5mm Crystal [Digikey: -10-70°C: 644-1049-1-ND -40-125°C: 644-1129-2-ND] 16.0 MHz 10pF 10ppm 3.2 x 2.5mm Crystal [Digikey: 644-1100-1-ND] 27.12 MHz 18pF 30ppm 3.2 x 2.5mm Crystal [Digikey: 887-1424-1-ND] 27.12MHz 10pF 10ppm 3.2 x 2.5mm Crystal [Digikey: 887-1329-1-ND] 4.9 x 1.8mm - MEMs SMT Crystal 32.768 KHz 12.5pF 20ppm 4.9 x 1.8mm Crystal [Digikey: SE2415CT-ND] 8.0 x 3.8mm - Surface Mount Crystal 32.768kHz 12.5pF 20ppm -40°C-85°C [Digikey: 535-9166-2-ND] Cylinder 32.768KHz Cylinder Crystal (2x6mm body) [Ex. Digikey: 300-8341-2-ND]; PARTNO: ABLS-8.000MHZ-B4-T,ABRACON,,815-ABLS-8.0M-T,Crystals 8.000MHz 30ppm -20C +70C 18pF, REF9

## Board
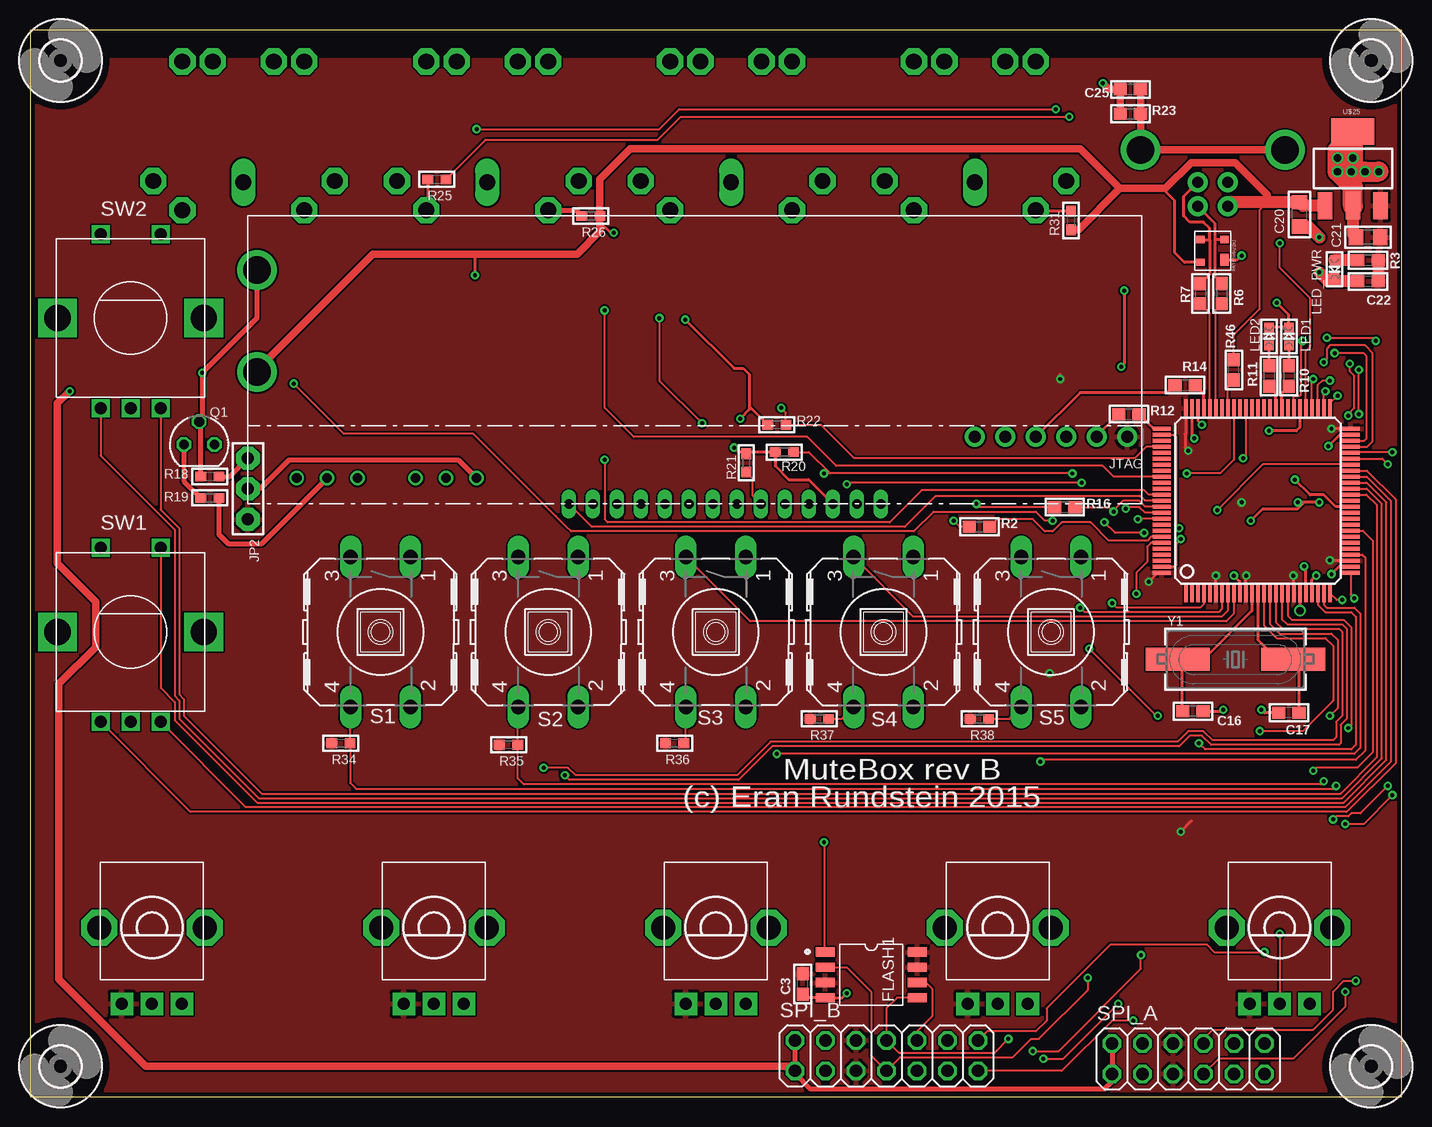
[diagram p3: board, top side]
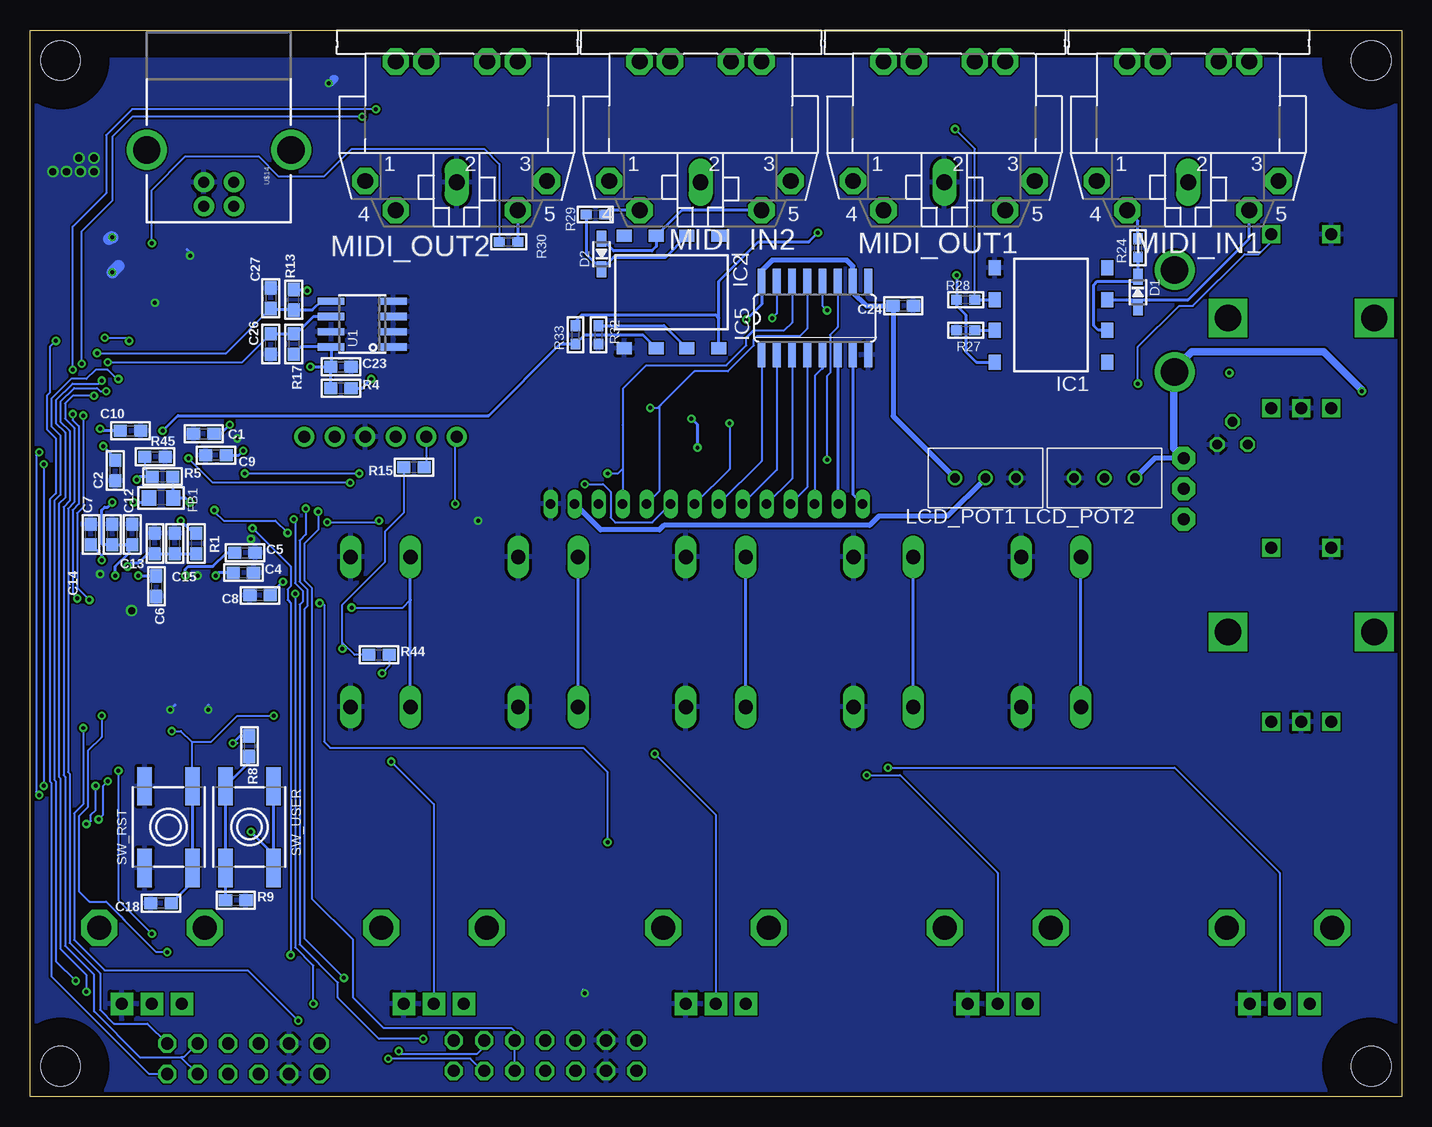
[diagram p4: board, bottom side, seen from below]

Size 114.3 x 88.9 mm. Coordinates in mm from the lower left corner, seen from the top.
Outline: 0,0 114.3,0 114.3,88.9 0,88.9 0,0
Copper layers (1*16): Top 0.0356mm / dielectric 1.5011mm / Bottom 0.0356mm
Design rules "oshpark_2layer *": minimum track width 6mil, minimum drill 13mil, track to track 6mil, track to pad 6mil, pad to pad 6mil, via to via 6mil, smd to smd 6mil, copper to edge 15mil, drill to drill 6mil, minimum pad ring 7mil, minimum via ring 7mil, stop-mask expansion 3mil, vias tented up to drill 0mil, thermal gap 10mil

### Footprints (pad centres in the part's own frame; a part is rotated, then mirrored left to right if it is on the bottom)
0603 = smd 1.1 x 1: 1 -0.85,0; 2 0.85,0
_0805 = smd 1.2 x 1.3: 1 -1.016,0; 2 1.016,0
SOD-323 = smd 1.35 x 0.8: A 1.27,0; C -1.27,0
SOIC-8-WIDE = smd 0.762 x 1.6: 1 -1.905,-3.84; 2 -0.635,-3.84; 3 0.635,-3.84; 4 1.905,-3.84; 5 1.905,3.84; 6 0.635,3.84; 7 -0.635,3.84; 8 -1.905,3.84
3,3 = hole 3.3: 0,0
SO8-GW300 = smd 1 x 1.27: 1 -4.69,3.937; 2 -4.69,1.27; 3 -4.69,-1.27; 4 -4.69,-3.937; 5 4.69,-3.937; 6 4.69,-1.27; 7 4.69,1.27; 8 4.69,3.937
SO16 = smd 0.66 x 2.032: 1 -4.445,-3.073; 2 -3.175,-3.073; 3 -1.905,-3.073; 4 -0.635,-3.073; 5 0.635,-3.073; 6 1.905,-3.073; 7 3.175,-3.073; 8 4.445,-3.073; 9 4.445,3.073; 10 3.175,3.073; 11 1.905,3.073; 12 0.635,3.073; 13 -0.635,3.073; 14 -1.905,3.073; 15 -3.175,3.073; 16 -4.445,3.073
JUMPER3 = drill 1 pad 1.93 octagon: 1 -2.54,0; 2 0,0; 3 2.54,0
1X06_ROUND = drill 1 pad 1.676: 1 -6.35,0; 2 -3.81,0; 3 -1.27,0; 4 1.27,0; 5 3.81,0; 6 6.35,0
NHD-C0220AA-FSW-FTW = drill 2.3: A -4.25,11; K -4.25,19.5 | drill 0.8 long: DB0 35.75,0; DB1 33.75,0; DB2 31.75,0; DB3 29.75,0; DB4 27.75,0; DB5 25.75,0; DB6 23.75,0; DB7 21.75,0; E 37.75,0; GND 47.75,0; R/W 39.75,0; RS 41.75,0; V5 45.75,0; VDD 43.75,0
67W = drill 0.8: P$1 -2.54,0; P$2 0,0; P$3 2.54,0
CHIPLED_0603 = smd 0.8 x 0.8: A 0,-0.75; C 0,0.75
CP-2350 = drill 1.321 pad 2.184 octagon: 1 7.62,12.58; 3 -7.52,12.58; 4 5.08,15.02; 5 -5.08,15.02; PE -2.54,2.62; PE1 -5.08,2.62; PE2 5.08,2.62; PE@ 2.54,2.62 | drill 1.321 long: 2 0,12.68
PRTR5V0U2X = smd 1 x 0.7: P$1 -0.75,-1 | smd 0.6 x 0.7: P$2 0.95,-1; P$3 0.95,1; P$4 -0.95,1
SOT54A = drill 0.813 octagon: B 0,1.905; C -1.27,0; E 1.27,0
_0603 = smd 0.9 x 0.8: 1 -0.762,0; 2 0.762,0
ALPS_POT_SFE = drill 1 pad 1.88 square: P$1 -2.5,6.35; P$2 0,6.35; P$3 2.5,6.35 | drill 2 octagon: P$4 -4.4,0; P$5 4.4,0
B3F-40XX = drill 1.194 long: 1 -6.248,2.489; 2 6.248,2.489; 3 -6.248,-2.489; 4 6.248,-2.489
2X06 = drill 1.016 octagon: 1 -6.35,-1.27; 2 -6.35,1.27; 3 -3.81,-1.27; 4 -3.81,1.27; 5 -1.27,-1.27; 6 -1.27,1.27; 7 1.27,-1.27; 8 1.27,1.27; 9 3.81,-1.27; 10 3.81,1.27; 11 6.35,-1.27; 12 6.35,1.27
2X07 = drill 1.016 octagon: 1 -7.62,-1.27; 2 -7.62,1.27; 3 -5.08,-1.27; 4 -5.08,1.27; 5 -2.54,-1.27; 6 -2.54,1.27; 7 0,-1.27; 8 0,1.27; 9 2.54,-1.27; 10 2.54,1.27; 11 5.08,-1.27; 12 5.08,1.27; 13 7.62,-1.27; 14 7.62,1.27
100LQFP = smd 1.5 x 0.3: 1 -6.18,9.08; 2 -6.18,8.58; 3 -6.18,8.08; 4 -6.18,7.58; 5 -6.18,7.08; 6 -6.18,6.58; 7 -6.18,6.08; 8 -6.18,5.58; 9 -6.18,5.08; 10 -6.18,4.58; 11 -6.18,4.08; 12 -6.18,3.58; 13 -6.18,3.08; 14 -6.18,2.58; 15 -6.18,2.08; 16 -6.18,1.58; 17 -6.18,1.08; 18 -6.18,0.58; 19 -6.18,0.08; 20 -6.18,-0.42; 21 -6.18,-0.92; 22 -6.18,-1.42; 23 -6.18,-1.92; 24 -6.18,-2.42; 25 -6.18,-2.92; 51 9.26,-2.92; 52 9.26,-2.42; 53 9.26,-1.92; 54 9.26,-1.42; 55 9.26,-0.92; 56 9.26,-0.42; 57 9.26,0.08; 58 9.26,0.58; 59 9.26,1.08; 60 9.26,1.58; 61 9.26,2.08; 62 9.26,2.58; 63 9.26,3.08; 64 9.26,3.58; 65 9.26,4.08; 66 9.26,4.58; 67 9.26,5.08; 68 9.26,5.58; 69 9.26,6.08; 70 9.26,6.58; 71 9.26,7.08; 72 9.26,7.58; 73 9.26,8.08; 74 9.26,8.58; 75 9.26,9.08 | smd 0.3 x 1.5: 26 -4.46,-4.64; 27 -3.96,-4.64; 28 -3.46,-4.64; 29 -2.96,-4.64; 30 -2.46,-4.64; 31 -1.96,-4.64; 32 -1.46,-4.64; 33 -0.96,-4.64; 34 -0.46,-4.64; 35 0.04,-4.64; 36 0.54,-4.64; 37 1.04,-4.64; 38 1.54,-4.64; 39 2.04,-4.64; 40 2.54,-4.64; 41 3.04,-4.64; 42 3.54,-4.64; 43 4.04,-4.64; 44 4.54,-4.64; 45 5.04,-4.64; 46 5.54,-4.64; 47 6.04,-4.64; 48 6.54,-4.64; 49 7.04,-4.64; 50 7.54,-4.64; 76 7.54,11.1; 77 7.04,11.1; 78 6.54,11.1; 79 6.04,11.1; 80 5.54,11.1; 81 5.04,11.1; 82 4.54,11.1; 83 4.04,11.1; 84 3.54,11.1; 85 3.04,11.1; 86 2.54,11.1; 87 2.04,11.1; 88 1.54,11.1; 89 1.04,11.1; 90 0.54,11.1; 91 0.04,11.1; 92 -0.46,11.1; 93 -0.96,11.1; 94 -1.46,11.1; 95 -1.96,11.1; 96 -2.46,11.1; 97 -2.96,11.1; 98 -3.46,11.1; 99 -3.96,11.1; 100 -4.46,11.1
ALPS_EC12E_SW = drill 1 square: A -2.5,-7.5; B 2.5,-7.5; C 0,-7.5; D -2.5,7; E 2.5,7 | drill 2.2 square: GND1 -6.1,0; GND2 6.1,0
EVQ-Q2 = smd 3.2 x 1.2: A -3.4,-2; A' 3.4,-2; B -3.4,2; B' 3.4,2
SOIC8_150MIL = smd 0.6 x 2.2: 1 -1.905,-2.6; 2 -0.635,-2.6; 3 0.635,-2.6; 4 1.905,-2.6; 5 1.905,2.6; 6 0.635,2.6; 7 -0.635,2.6; 8 -1.905,2.6
USB-B-PTH = drill 0.914 pad 1.676: D+ 0,1.25; D- 1.981,1.25; GND 0,-1.25; VBUS 1.981,-1.25 | drill 2.286: S1 -2.718,-6.02; S2 -2.718,6.02
SOT223 = smd 1.219 x 2.235: 1 -2.311,-3.099; 2 0,-3.099; 3 2.311,-3.099 | smd 3.6 x 2.2: 4 0,3.099
HC49UP = smd 5.334 x 1.93: 1 -4.826,0; 2 4.826,0

### Placement (x,y rotation side)
C1  99.82,55.24 0 bottom
C2  107.19,52.2 90 bottom
C3  64.39,9.4 90 top
C4  96.52,43.69 0 bottom
C5  96.39,45.34 0 bottom
C6  103.76,42.55 270 bottom
C7  109.22,46.86 90 bottom
C8  95.12,41.78 180 bottom
C9  98.81,53.47 180 bottom
C10  105.92,55.5 0 bottom
C12  105.79,46.86 90 bottom
C13  103.89,46.1 270 bottom
C14  107.44,46.86 270 bottom
C15  102.23,46.1 90 bottom
C16  96.9,32.13 180 top
C17  104.9,32 180 top
C18  103.38,16.13 180 bottom
C20  105.79,73.53 90 top
C21  111.51,71.63 180 top
C22  111.51,67.94 180 top
C23  88.39,60.83 0 bottom
C24  41.53,65.91 180 bottom
C25  91.69,83.95 180 top
C26  94.23,62.74 90 bottom
C27  94.23,66.55 270 bottom
D1  21.97,67.06 270 bottom
D2  66.67,70.23 90 bottom
FB1  103.38,49.91 180 bottom
FLASH1  70.1,10.16 270 top
H1  2.54,86.36 0 top
H2  111.76,86.36 0 top
H3  111.76,2.54 0 top
H4  2.54,2.54 0 top
IC1  29.21,65.15 180 bottom
IC2  60.83,67.06 270 bottom
IC5  48.9,64.9 0 bottom
JP2  18.16,50.67 270 top
JTAG  85.09,54.99 180 top
LCD1  23.16,49.4 0 top
LCD_POT1  34.67,51.56 180 bottom
LCD_POT2  24.77,51.56 180 bottom
LED1  104.9,63.37 0 top
LED2  103.25,63.37 0 top
LED_PWR  108.71,68.96 180 top
MIDI_IN1  17.78,88.9 180 bottom
MIDI_IN2  58.42,88.9 180 bottom
MIDI_OUT1  38.1,88.9 180 bottom
MIDI_OUT2  78.74,88.9 180 bottom
PRTR5V0U2X1  98.55,70.48 90 top
Q1  14.1,54.36 0 top
R1  100.46,46.1 270 bottom
R2  79.12,47.5 0 top
R3  111.51,69.72 0 top
R4  88.39,59.05 0 bottom
R5  103.25,51.69 0 bottom
R6  99.31,66.93 270 top
R7  97.54,66.93 270 top
R8  96.01,29.21 270 bottom
R9  97.16,16.38 0 bottom
R10  104.9,60.07 270 top
R11  103.25,60.07 270 top
R12  91.57,56.9 0 top
R13  92.33,66.42 90 bottom
R14  96.27,59.31 0 top
R15  82.3,52.45 180 bottom
R16  86.23,49.15 0 top
R17  92.33,62.74 270 bottom
R18  14.99,51.69 0 top
R19  14.99,49.91 0 top
R20  62.87,53.72 0 top
R21  59.69,52.83 270 top
R22  62.23,56.01 0 top
R23  91.69,81.92 0 top
R24  21.97,70.74 90 bottom
R25  33.91,76.45 180 top
R26  46.74,73.41 180 top
R27  36.32,63.88 180 bottom
R28  36.32,66.42 180 bottom
R29  67.18,73.53 0 bottom
R30  74.42,71.25 0 bottom
R31  86.74,73.03 90 top
R32  66.93,63.5 270 bottom
R33  68.83,63.5 90 bottom
R34  25.91,29.46 180 top
R35  39.88,29.34 180 top
R36  53.72,29.46 180 top
R37  65.79,31.5 180 top
R38  79.12,31.5 180 top
R39  10.16,14.1 180 top
R40  33.66,14.1 180 top
R41  57.15,14.1 180 top
R42  80.64,14.1 180 top
R43  104.14,14.1 180 top
R44  85.22,36.83 0 bottom
R45  103.89,53.34 0 bottom
R46  100.33,60.58 90 top
S1  29.21,38.73 270 top
S2  43.18,38.73 270 top
S3  57.15,38.73 270 top
S4  71.12,38.73 270 top
S5  85.09,38.73 270 top
SPI_A  96.52,3.17 0 top
SPI_B  71.37,3.43 0 top
STM32F407XX1  105.41,48.13 90 top
SW1  8.38,38.73 0 top
SW2  8.38,64.9 0 top
SW_RST  102.74,22.48 90 bottom
SW_USER  96.01,22.48 270 bottom
U1  86.61,64.39 90 bottom
U$14  98.55,76.2 270 bottom
U$25  110.24,77.34 0 top
Y1  100.46,36.45 0 top

### Tracks (layer width: path | path; a pad name or v marks a point on that pad's centre or on a via)
3.3V  (via drill 0.33)
  Top 0.152: v84.96,35.31 85.34,35.31
  Top 0.254: STM32F407XX1.50 v108.46,55.67 | STM32F407XX1.75 96.33,55.31 96.27,55.24 96.27,54.1 v96.52,53.85 | STM32F407XX1.19 105.33,43.39 v105.28,43.43 | STM32F407XX1.6 v98.83,43.43 | STM32F407XX1.11 101.33,43.42 v101.35,43.43 | STM32F407XX1.28 108.36,44.67 v108.33,44.7 | v85.85,59.82 85.85,60.2 | v95.89,22.1 96.77,22.99 | 93.87,43.67 93.85,43.69 93.85,43.56 v93.22,42.93
  Top 1.016: R3.2 C22.1
  Bottom 0.152: R44.2 84.37,35.9 v84.96,35.31
  Bottom 0.254: C10.1 108.28,55.5 v108.46,55.67 | C9.1 96.9,53.47 v96.52,53.85 | v108.33,44.7 108.2,44.83 108.2,44.96 108.33,45.09 108.33,45.12 C7.1 | v105.28,43.43 103.8,43.43 C6.1 | R5.2 102.4,50.29 102.36,50.25 FB1.1 101.35,49.91 v100.97,49.53 | R4.2 86.61,59.05 v85.85,59.82 | SW_USER.B SW_USER.B' 94.01,20.23 v95.89,22.1 | C4.1 98.58,43.69 v98.83,43.43 | v101.35,43.43 101.35,43.94 101.09,44.2 99.06,44.2 97.92,45.34 C5.1 | C8.1 94.27,42 94.15,42 v93.22,42.93
  pour Top: 0.25,86.36 114.05,86.36 114.05,0.51 0.25,0.51
5.0V  (via drill 0.33)
  Top 0.152: R46.2 100.33,63.5 102.49,65.66 102.49,73.91 103.12,74.55
  Top 0.254: PRTR5V0U2X1.P$4 96.2,69.53 95.38,70.36 95.38,74.68 94.36,75.69 | v37.08,68.45 37.08,70.1 36.96,70.23 | v48.64,72.01 48.39,72.01 47.5,72.9
  Top 0.406: R18.2 16.64,51.69 JP2.1 | SPI_A.1 SPI_A.2 90.17,1.27 89.53,0.64 65.02,0.64 63.75,1.91 SPI_B.1 SPI_B.2
  Top 0.61: 103.12,74.55 103.12,75.18 100.46,77.85 96.77,77.85 94.61,75.69 94.36,75.69 90.81,75.69 | 90.81,75.69 87.5,78.99 50.04,78.99 47.5,76.45 R26.1 47.5,72.9 47.5,72.14 45.59,70.23 36.96,70.23 28.57,70.23 18.98,60.64 18.98,60.47 LCD1.A | R31.1 87.38,72.26 90.81,75.69 | v3.3,58.8 2.29,57.78 2.29,44.45 5.46,41.27 5.46,37.47 2.41,34.42 2.41,9.78 9.65,2.54 63.37,2.54 SPI_B.1
  Top 1.016: U$25.1 106.1,74.24 C20.2 103.12,74.55 100.13,74.55 U$14.VBUS
  Bottom 0.254: IC1.8 35.43,61.21 36.32,62.1 36.32,65.15 37.08,65.91 R28.2 v37.08,68.45 | IC2.8 56.9,64.9 | 56.9,64.9 56.9,67.94 53.59,71.25 49.4,71.25 v48.64,72.01 | R33.2 68.83,64.64 68.33,65.15 57.15,65.15 56.9,64.9
  Bottom 0.406: JP2.1 20.57,53.21 LCD_POT2.P$1
  Bottom 0.61: JP2.1 18.98,54.03 18.98,60.34 LCD1.A 18.91,60.7 17.51,62.1 6.48,62.1 3.3,58.93 v3.3,58.8
A0  (via drill 0.33)
  Top 0.152: STM32F407XX1.16 103.83,39.55 104.39,38.99 109.09,38.99 109.35,38.73 109.35,31.75 108.84,31.24 108.84,29.97 108.58,29.72 98.55,29.72 97.79,30.48 96.52,30.48 95.63,29.59 61.72,29.59 58.93,26.8 45.47,26.8 44.83,27.43 v42.8,27.43
  Bottom 0.152: v42.8,27.43 18.92,27.43 10.16,18.67 R39.P$2
A1  (via drill 0.33)
  Top 0.152: STM32F407XX1.17 104.33,39.81 104.78,39.37 109.35,39.37 109.73,38.99 109.73,31.5 109.22,30.99 109.22,29.46 109.09,29.34 98.42,29.34 97.66,30.1 96.65,30.1 95.76,29.21 61.85,29.21 59.05,26.42 44.96,26.42 v44.58,26.8
  Bottom 0.152: v44.58,26.8 41.78,26.8 33.66,18.67 R40.P$2
A2  (via drill 0.33)
  Top 0.152: STM32F407XX1.24 107.83,41.01 108.08,40.77 110.36,40.77 110.87,40.26 110.87,29.08 110.36,28.57 v62.23,28.57
  Bottom 0.152: v62.23,28.57 57.15,23.5 R41.P$2
A3  (via drill 0.33)
  Top 0.152: STM32F407XX1.29 111.04,45.17 111.25,44.96 111.25,28.83 110.49,28.07 84.33,28.07 v84.2,27.94
  Bottom 0.152: v84.2,27.94 80.64,24.38 R42.P$2
A4  (via drill 0.33)
  Top 0.152: STM32F407XX1.33 111.07,47.17 111.89,46.35 111.89,28.7 110.62,27.43 107.19,27.43 v106.93,27.18 | v104.14,13.59 R43.P$2
  Bottom 0.152: v106.93,27.18 106.93,16.38 v104.14,13.59
A_RC1  (via drill 0.33)
  Top 0.152: STM32F407XX1.51 108.33,57.78 v108.97,58.42
  Bottom 0.152: v108.97,58.42 110.74,58.42 111.38,57.78 111.38,56.52 110.62,55.75 110.62,49.53 111.12,49.02 111.12,27.05 111,26.92 111,12.83 108.46,10.29 108.46,7.24 107.31,6.1 104.52,6.1 SPI_A.12
A_RC2  (via drill 0.33)
  Top 0.152: STM32F407XX1.57 105.33,58.34 105.41,58.42 105.79,58.42 105.92,58.55 105.92,62.87 v106.05,62.99 | v108.08,63.25 111.89,63.25 v112.14,62.99
  Bottom 0.152: v112.14,62.99 112.65,62.48 112.65,58.67 112.9,58.42 112.9,55.63 112.14,54.86 112.14,50.29 112.65,49.78 112.65,26.29 112.52,26.16 112.52,10.03 104.39,1.91 SPI_A.11 | v108.08,63.25 106.3,63.25 v106.05,62.99
A_SC  (via drill 0.33)
  Top 0.152: STM32F407XX1.52 107.83,58.68 v107.95,58.8
  Bottom 0.152: 101.73,3.3 105.16,3.3 108.97,7.11 108.97,10.16 111.38,12.57 111.38,26.67 111.51,26.8 111.51,49.15 111,49.66 111,55.5 111.76,56.26 111.76,57.91 110.62,59.05 108.71,59.05 108.46,58.8 v107.95,58.8 | 101.73,3.3 SPI_A.9 | SPI_A.10 101.47,3.3 101.73,3.3
A_SI  (via drill 0.33)
  Top 0.152: STM32F407XX1.53 107.33,59.32 107.7,59.69 v108.33,59.69 | SPI_A.7 99.06,3.17 105.28,3.17 109.6,7.49 v109.6,8.76
  Bottom 0.152: v109.6,8.76 109.6,10.16 111.76,12.32 111.76,26.54 111.89,26.67 111.89,49.4 111.38,49.91 111.38,55.37 112.14,56.13 112.14,58.04 110.74,59.44 108.58,59.44 v108.33,59.69
A_SO  (via drill 0.33)
  Top 0.152: SPI_A.8 97.79,4.83 98.55,5.59 106.93,5.59 108.58,7.24 108.58,8.76 109.47,9.65 v110.49,9.65 | STM32F407XX1.54 106.83,59.71 v106.93,59.82
  Bottom 0.152: v110.49,9.65 112.14,11.3 112.14,26.29 112.27,26.42 112.27,49.66 111.76,50.16 111.76,55.12 112.52,55.88 112.52,58.17 110.87,59.82 109.6,59.82 108.84,60.58 107.82,60.58 107.06,59.82 v106.93,59.82
B_RC1  (via drill 0.33)
  Top 0.152: STM32F407XX1.77 95.32,55.17 95.5,54.99 95.5,47.62 v95.76,47.37 | v83.57,3.81 85.72,3.81 92.58,10.67 v92.58,11.81
  Bottom 0.152: v95.76,47.37 92.58,44.2 92.58,42.55 92.84,42.29 92.84,41.4 92.58,41.15 v92.58,11.81 | SPI_B.12 76.45,4.19 77.09,3.56 83.31,3.56 v83.57,3.81
B_RC2  (via drill 0.33)
  Top 0.152: STM32F407XX1.95 93.42,46.17 93.09,45.85 93.09,44.58 92.2,43.69 v92.2,41.91 | v84.45,3.17 86.11,3.17 v90.68,7.75
  Bottom 0.152: v92.2,41.91 92.2,12.45 90.68,10.92 v90.68,7.75 | SPI_B.11 76.58,2.16 77.6,3.17 v84.45,3.17
B_RC3  (via drill 0.33)
  Top 0.152: STM32F407XX1.15 103.33,39.42 104.14,38.61 108.46,38.61 108.97,38.1 108.97,32.38 v108.33,31.75 | SPI_B.14 79.76,5.46 83.82,5.46 84.71,6.35 84.71,7.37 90.04,12.7 98.04,12.7 98.68,12.06 v102.87,12.06
  Bottom 0.152: v108.33,31.75 108.33,29.97 109.47,28.83 109.47,24.13 110.24,23.37 110.24,17.14 109.35,16.26 107.95,16.26 106.74,15.05 106.43,14.73 103.76,12.06 v102.87,12.06
B_RC4  (via drill 0.33)
  Top 0.152: STM32F407XX1.18 104.83,40.08 105.16,39.75 109.47,39.75 110.11,39.12 110.11,30.99 v109.86,30.73 | v91.95,6.35 90.17,6.35 85.98,2.16 SPI_B.13
  Bottom 0.152: v109.86,30.73 109.86,24.38 110.62,23.62 110.62,13.08 108.08,10.54 96.14,10.54 v91.95,6.35
B_RC5  (via drill 0.33)
  Top 0.152: STM32F407XX1.4 97.83,41.06 97.54,40.77 90.55,40.77 v90.17,41.15 | v66.17,21.21 66.17,12.16 FLASH1.1
  Bottom 0.152: v90.17,41.15 89.92,41.15 89.79,41.02 89.79,29.59 89.28,29.08 68.2,29.08 67.56,28.45 66.29,27.18 66.17,27.05 v66.17,21.21
B_SC  (via drill 0.33)
  Top 0.152: STM32F407XX1.89 92.94,49.17 92.46,49.66 91.06,49.66 90.3,48.9 v90.3,48.77 89.92,49.15 R16.2 | FLASH1.6 74.68,9.53 75.18,9.02 75.18,6.73 73.98,5.52 73.98,4.76 SPI_B.10
  Bottom 0.152: v90.3,48.77 90.3,47.24 91.44,46.1 91.44,43.05 90.81,42.42 90.81,16.51 87.38,13.08 87.38,8.26 84.84,5.71 74.17,5.71 73.91,5.46 SPI_B.10 SPI_B.9
B_SI  (via drill 0.33)
  Top 0.152: STM32F407XX1.90 92.93,48.67 92.46,49.15 91.44,49.15 v91.31,49.02 | FLASH1.2 68.07,10.79 70.1,8.76 70.1,3.43 SPI_B.7 72.52,3.3 81.92,3.3 83.44,4.83 84.07,4.83 88.14,8.89 v88.14,9.91
  Bottom 0.152: v91.31,49.02 91.31,46.86 91.82,46.35 91.82,42.93 91.19,42.29 91.19,40.89 91.44,40.64 91.44,13.21 v88.14,9.91
B_SO  (via drill 0.33)
  Top 0.152: STM32F407XX1.91 92.37,48.17 v92.33,48.13 | v81.53,4.83 80.39,3.68 72.39,3.68 SPI_B.8 71.37,7.37 72.26,8.26 FLASH1.5
  Bottom 0.152: v92.33,48.13 92.2,48.01 92.2,42.8 91.57,42.16 91.57,41.27 91.82,41.02 91.82,12.7 88.65,9.53 88.65,8.26 85.22,4.83 v81.53,4.83
BOOT1  (via drill 0.33)
  Top 0.254: STM32F407XX1.37 108.81,49.17 107.82,50.16 106.68,50.16 v105.41,51.44
  Bottom 0.152: R45.1 104.74,52.32 R5.1
  Bottom 0.254: R5.1 105.16,51.69 v105.41,51.44
GND  (via drill 0.33, 0.6)
  Top 0.152: R2.1 77.47,47.5 v76.96,48.01
  Top 0.254: STM32F407XX1.74 96.83,55.06 v97.03,54.86 | STM32F407XX1.10 100.83,42.93 v100.33,43.43 | STM32F407XX1.27 109.07,44.17 v108.46,43.56 | STM32F407XX1.20 v105.83,40.51 | STM32F407XX1.99 95.35,44.17 95.5,44.32 95.5,46.1 v95.89,46.48 | PRTR5V0U2X1.P$1 100.6,69.73 v100.97,70.1 | LED2.C LED1.C 104.9,65.15 v103.89,66.17 | C16.1 99.31,32.13 v99.44,32.26 | C17.2 102.87,32 v102.62,32.26 | C3.1 64.68,8.26 FLASH1.4 67.69,8.26 v68.07,8.64
  Top 0.61: R23.1 C25.2 89.92,83.95 v89.41,84.45
  Top 1.016: C20.1 106.55,72.52 v107.44,71.63 | U$25.2 110.24,71.88 C21.2 | C22.2 108.46,67.94 | 108.46,67.94 108.2,67.94 v107.44,68.71 | LED_PWR.C 108.71,68.2 108.46,67.94
  Top 1.676: U$25.4 v110.24,78.23 110.24,77.6 110.74,77.09 v111.25,77.09 v112.39,77.09 | U$25.2 110.24,75.82 v108.97,77.09 v108.97,78.23 108.97,78.87 109.09,78.99
  Bottom 0.152: v76.96,48.01 76.96,48.13 76.83,48.26
  Bottom 0.254: v100.97,70.1 100.97,70.36 101.22,70.61 | v103.89,66.17 103.76,66.29 | v99.44,32.26 99.44,32.64 | v102.62,32.26 102.23,32.64 | v68.07,8.64 68.07,8.76 68.2,8.89
  Bottom 0.61: v89.41,84.45 89.28,84.45 88.9,84.84 89.03,84.84
  Bottom 1.016: v107.44,71.63 107.57,71.63 107.7,71.5 | v107.44,68.71 106.93,69.22
  other vias: 110.11,77.09
  pour Bottom: 0.25,86.36 114.05,86.36 114.05,0.51 0.25,0.51
LCD_B-  (via drill 0.33)
  Top 0.406: R18.1 14.22,56.13 Q1.B 14.35,56.52 v14.35,60.33 18.91,64.89 LCD1.K
  Bottom 0.406: 14.35,56.52 Q1.B
LCD_D0  (via drill 0.33)
  Top 0.152: v52.45,64.9 52.45,59.69 v56.01,56.13
  Bottom 0.152: IC5.15 52.07,65.28 v52.45,64.9 | v56.01,56.13 56.01,52.31 LCD1.DB0
LCD_D1
  Bottom 0.152: IC5.1 53.34,52.98 LCD1.DB1
LCD_D2
  Bottom 0.152: IC5.2 52.07,52.25 LCD1.DB2
LCD_D3
  Bottom 0.152: 50.8,61.11 50.8,51.52 LCD1.DB3
  Bottom 0.254: IC5.3 50.8,61.11
LCD_D4
  Bottom 0.152: IC5.4 49.53,50.79 LCD1.DB4
LCD_D5
  Bottom 0.152: 48.26,60.71 48.9,60.07 48.9,49.42 LCD1.DB5
  Bottom 0.254: IC5.5 48.26,60.71
LCD_D6
  Bottom 0.254: IC5.6 46.99,49.48 LCD1.DB6
LCD_D7
  Top 0.152: STM32F407XX1.88 92.95,49.67 92.58,50.04 75.44,50.04 72.9,47.5 46.82,47.5 LCD1.DB7
  Bottom 0.254: IC5.7 45.72,50.21 LCD1.DB7
LCD_E1  (via drill 0.33)
  Top 0.152: STM32F407XX1.65 101.33,53.45 v101.09,53.21 | R21.2 60.2,51.56 60.2,50.12 LCD1.E | v87.63,51.18 68.2,51.18 v68.07,51.05
  Bottom 0.152: v87.63,51.18 99.06,51.18 v101.09,53.21 | v68.07,51.05 66.55,51.05 65.91,50.42 65.91,48.26 65.53,47.88 62.44,47.88 LCD1.E
LCD_RS  (via drill 0.33)
  Top 0.152: v86.87,51.94 66.67,51.94 | 66.67,51.94 v66.17,51.94 | STM32F407XX1.67 100.33,53.09 99.19,51.94 v96.39,51.94 | R20.2 64.9,53.72 66.67,51.94
  Bottom 0.152: v96.39,51.94 v86.87,51.94 | IC5.14 50.8,64.52 51.44,63.88 53.98,63.88 | 54.61,63.25 54.61,62.61 56.26,60.96 62.95,60.96 64.9,59.01 64.9,56.01 64.92,55.99 64.92,52.32 | 64.92,52.32 LCD1.RS | v66.17,51.94 65.3,51.94 64.92,52.32
  Bottom 0.254: 54.61,63.25 53.98,63.88
LCD_RW  (via drill 0.33)
  Top 0.152: STM32F407XX1.79 93.03,54.17 92.08,53.21 68.7,53.21 65.9,56.01 R22.2 62.99,57.02 v62.61,57.4
  Bottom 0.152: IC5.13 49.53,64.01 50.16,63.37 53.72,63.37 53.98,63.12 53.98,62.61 56.13,60.45 58.93,60.45 61.72,57.66 61.85,57.53 | 61.85,57.53 61.85,50.47 LCD1.R/W | v62.61,57.4 61.98,57.4 61.85,57.53
LCD_SER_RCLK  (via drill 0.33)
  Top 0.152: STM32F407XX1.84 90.31,51.67 89.41,52.58 67.18,52.58 64.77,54.99 50.29,54.99 47.88,57.4 v47.88,65.53
  Bottom 0.152: IC5.12 48.26,65.91 v47.88,65.53
LCD_SER_SCLK  (via drill 0.33)
  Top 0.152: STM32F407XX1.87 93.21,50.17 92.84,50.55 74.3,50.55 71.63,47.88 48.13,47.88 47.88,48.13 v47.88,53.09
  Bottom 0.152: IC5.11 46.99,64.14 47.62,63.5 47.62,60.33 47.88,60.07 v47.88,53.09
LCD_V0
  Bottom 0.406: LCD_POT1.P$2 37.85,48.39 43.56,48.39 44.32,47.62 61.47,47.62 61.85,47.24 66.76,47.24 LCD1.V5
LCD_VD  (via drill 0.33)
  Top 0.254: v54.61,64.77 58.67,60.71 59.44,60.71 59.94,60.2 59.94,57.53 | 59.94,57.53 R22.1 | R20.1 59.82,53.72 R21.1 | R20.1 59.05,53.72 v58.67,54.1 | 59.94,57.53 59.94,57.28 v59.18,56.52 | R20.1 62.1,52.58 63.25,51.44 64.88,51.44 LCD1.VDD
  Top 0.406: JP2.2 19.18,50.67 21.59,53.09 35.69,53.09 LCD_POT1.P$3
  Bottom 0.254: IC5.16 53.34,66.04 v54.61,64.77 | v58.67,54.1 58.67,56.01 v59.18,56.52
  Bottom 0.406: IC5.16 53.34,68.83 52.45,69.72 46.23,69.72 45.72,69.22 IC5.10 45.72,67.06 44.58,65.91 C24.2 42.38,56.73 LCD_POT1.P$3
LED1
  Top 0.254: STM32F407XX1.59 104.33,58.65 R10.2
LED2
  Top 0.254: STM32F407XX1.60 103.83,58.64 R11.2
MIDI_IN1  (via drill 0.33)
  Top 0.152: v37.21,80.64 52.45,80.64 54.1,82.3 v85.47,82.3 | STM32F407XX1.26 110.05,41.84 v110.36,41.53 | v110.74,56.9 v110.74,60.58
  Bottom 0.152: R28.1 35.56,78.99 v37.21,80.64 | v85.47,82.3 105.79,82.3 107.95,80.14 107.95,75.31 110.74,72.52 v110.74,60.58 | v110.74,56.9 110.74,56.39 110.24,55.88 110.24,49.4 110.74,48.9 110.74,41.91 v110.36,41.53
  Bottom 0.254: R28.1 IC1.6
MIDI_IN2  (via drill 0.33)
  Top 0.254: STM32F407XX1.56 105.83,55.79 105.54,55.5 v103.25,55.5
  Bottom 0.254: R33.1 68.07,63.5 63.24,63.5 IC2.6 | 68.96,62.61 R33.1 | v103.25,55.5 101.98,56.77 76.07,56.77 70.1,62.74 R33.1
MIDI_OUT1  (via drill 0.33)
  Top 0.152: R25.1 37.97,79.76 52.32,79.76 54.23,81.66 v86.61,81.66 | v109.35,41.4 108.88,41.4 STM32F407XX1.25 | v109.86,56.77 109.86,56.9 110.36,57.4 110.36,60.07 109.98,60.45 v109.98,61.09
  Top 0.254: STM32F407XX1.25 108.33,41.91
  Bottom 0.152: v86.61,81.66 105.79,81.66 107.44,80.01 107.44,74.68 109.98,72.14 v109.98,61.09 | v109.86,56.77 109.86,49.15 110.36,48.64 110.36,42.42 v109.35,41.4
MIDI_OUT2  (via drill 0.33)
  Top 0.152: v104.14,71.12 104.14,69.09 106.68,66.55 106.68,62.48 106.33,62.13 STM32F407XX1.55
  Bottom 0.152: v104.14,71.12 104.14,75.56 101.35,78.36 95.25,78.36 93.6,76.71 89.79,76.71 87.5,78.99 76.45,78.99 75.18,77.72 R30.1
N$1  (via drill 0.33)
  Top 0.254: STM32F407XX1.49 109.15,55.17 v108.2,54.23
  Bottom 0.254: v108.2,54.23 107.19,53.21 C2.2
N$2  (via drill 0.33)
  Top 0.254: STM32F407XX1.73 97.33,56.34 v97.66,56.01
  Bottom 0.254: C1.2 98.42,55.24 v97.66,56.01
N$3
  Top 0.152: STM32F407XX1.68 99.83,59.23 R46.1
N$5
  Top 0.152: STM32F407XX1.94 93.41,46.67 93.09,46.35 89.92,46.35 88.39,47.88 85.98,47.88 85.22,47.12 84.58,47.12 83.57,48.13 80.61,48.13 R2.2
N$6
  Top 0.254: STM32F407XX1.12 101.83,40.49 98.17,36.83 96.39,36.83 96.01,36.45 Y1.1 96.01,36.07 96.01,32.17 C16.2
N$7  (via drill 0.33)
  Top 0.254: v91.19,67.18 91.19,61.09 v90.93,60.83
  Bottom 0.254: C23.1 89.21,60.86 U1.8 91.73,62.48 R17.2 | R4.1 C23.1 | R13.2 91.27,67.27 v91.19,67.18 | v90.93,60.83 C23.1
N$8
  Top 1.016: R3.1 108.72,69.72 LED_PWR.A
N$9
  Top 0.254: STM32F407XX1.13 102.33,38.1 103.98,36.45 Y1.2 105.37,36.36 105.75,36.36 C17.1
N$10
  Top 0.254: 98.73,71.37 98.73,72.79 U$14.D- | 98.73,71.37 98.73,68.36 R6.1 | PRTR5V0U2X1.P$2 98.79,71.44 98.73,71.37
N$11
  Top 0.254: 98.3,71.37 98.3,68.54 R7.1 | PRTR5V0U2X1.P$3 98.24,71.44 98.3,71.37 | 98.3,71.37 98.3,72.39 97.79,72.9 96.65,72.9 96.14,73.41 96.14,75.04 U$14.D+
N$12
  Bottom 0.254: R9.1 98.01,16.39 SW_USER.A' SW_USER.A 96.01,27.88 R8.2
N$13
  Top 0.254: LED1.A R10.1
N$14
  Top 0.254: R11.1 LED2.A
N$15
  Top 0.254: JTAG.2 88.9,55.08 R12.1
N$16
  Top 0.254: R14.1 95.38,59.31 94.74,58.67 87.5,58.67 JTAG.4
N$17
  Bottom 0.152: JTAG.5 81.28,52.62 R15.1
N$18  (via drill 0.33)
  Top 0.152: R16.1 79.12,49.15 v78.87,49.4
  Top 0.254: 78.99,49.28 v78.87,49.4
  Bottom 0.152: v78.87,49.4 78.87,54.86 JTAG.6
N$19
  Top 0.406: Q1.C 12.83,51.31 R19.1
N$20
  Top 0.406: R19.2 15.75,46.86 16.51,46.1 19.3,46.1 LCD_POT2.P$2
N$21
  Top 0.61: U$14.S1 U$14.S2 92.54,78.93 R23.2 C25.1
N$23
  Top 0.254: R25.2 33.15,74.01 MIDI_OUT1.5
N$24
  Top 0.406: MIDI_OUT1.4 45.5,73.88 R26.2
N$25
  Bottom 0.254: R24.2 21.97,72.99 MIDI_IN1.4
N$26
  Bottom 0.254: R24.1 D1.C 22.35,67.94 25.4,67.94 25.65,67.69 25.65,64.26 25.27,63.88 IC1.2
N$27
  Bottom 0.254: D1.A 22.61,66.42 IC1.3 17.78,66.42 12.7,71.5 MIDI_IN1.5
N$28
  Bottom 0.254: R27.1 IC1.7
N$29
  Bottom 0.254: MIDI_OUT2.5 R30.2
N$30
  Top 0.254: R31.2 83.91,73.79 MIDI_OUT2.4
N$31
  Bottom 0.254: MIDI_IN2.4 66.07,73.88 R29.2
N$32
  Bottom 0.254: IC2.2 61.33,69.98 65.66,69.98 D2.C 67.94,70.23 R29.1
N$33
  Bottom 0.254: D2.A 65.66,70.48 62.48,70.48 62.1,70.87 IC2.3 59.97,73.88 MIDI_IN2.5
N$34
  Bottom 0.254: R32.1 61.46,64.26 IC2.7
NRST  (via drill 0.33)
  Top 0.152: STM32F407XX1.14 102.83,39.28 103.89,38.23 107.95,38.23 108.58,37.59 108.58,33.02 106.05,30.48 v102.49,30.48 | v93.98,31.75 93.85,31.75 v88.27,37.34
  Bottom 0.152: v102.49,30.48 101.73,30.48 100.84,29.59 | 100.84,29.59 100.84,25.97 SW_RST.A' | R15.2 83.15,48.68 84.71,47.12 84.71,44.58 88.27,41.02 88.27,37.85 | 100.84,29.59 99.19,29.59 97.03,31.75 v93.98,31.75 | v88.27,37.34 88.27,37.85 | R44.1 87.25,36.83 88.27,37.85
  Bottom 0.254: C18.1 100.74,17.91 SW_RST.A SW_RST.A'
SCL  (via drill 0.33)
  Top 0.152: STM32F407XX1.47 111.45,54.17 111.89,54.61 111.89,61.98 111.25,62.61 108.33,62.61 108.08,62.36 108.08,61.47 v107.82,61.21
  Bottom 0.152: C26.2 96.61,61.21 v107.82,61.21
  Bottom 0.254: U1.6 90.68,65.02 92.11,63.59 R17.1 C26.2
SCS_D0
  Top 0.152: STM32F407XX1.39 111.37,50.17 112.27,49.28 112.27,28.32 109.22,25.27 19.3,25.27 12.83,31.75 12.83,33.15 12.45,33.53 12.45,47.37 10.88,48.94 SW2.B
SCS_D1
  Top 0.152: STM32F407XX1.40 111.38,50.67 112.65,49.4 112.65,28.19 109.35,24.89 19.05,24.89 12.45,31.5 12.45,33.02 12.06,33.4 12.06,47.24 5.88,53.43 SW2.A
SCS_D2
  Top 0.152: STM32F407XX1.41 111.39,51.17 113.03,49.53 113.03,28.07 109.47,24.51 18.92,24.51 12.06,31.37 12.06,32.89 10.88,34.08 SW1.E
SCS_D3
  Top 0.152: STM32F407XX1.42 111.39,51.67 113.41,49.66 113.41,27.94 109.6,24.13 17.99,24.13 SW1.B
SCS_D4
  Top 0.152: STM32F407XX1.43 111.4,52.17 113.79,49.78 113.79,27.81 109.73,23.75 13.37,23.75 SW1.A
SCS_D5  (via drill 0.33)
  Top 0.152: 110.02,52.7 102.74,52.7 v98.93,48.9 | v92.84,46.99 90.42,46.99 v89.53,47.88 | v85.22,48.01 84.58,48.01 83.82,48.77 75.31,48.77 73.66,47.12 45.09,47.12 44.7,47.5 43.81,48.39 36.96,55.24 26.16,55.24 v21.97,59.44
  Top 0.254: 110.02,52.7 STM32F407XX1.44
  Bottom 0.152: 98.93,48.77 98.17,48.01 93.85,48.01 v92.84,46.99 | v89.53,47.88 85.34,47.88 v85.22,48.01 | v21.97,59.44 21.97,62.48 18.54,65.91 17.4,65.91 13.08,70.23 11.9,70.23 10.88,71.25 SW2.E
  Bottom 0.254: v98.93,48.9 98.93,48.77
SCS_D6  (via drill 0.33)
  Top 0.152: STM32F407XX1.45 112.69,53.17 v113.16,52.7 | v107.82,26.29 107.57,26.04 41.15,26.04 40.64,26.54 R35.1 40.64,32.44 S2.4 | v113.16,25.91 110.87,23.62 110.11,23.62 109.86,23.37 108.84,23.37 v108.58,23.11
  Bottom 0.152: v107.82,26.29 108.2,25.91 108.2,23.5 v108.58,23.11 | v113.16,52.7 v113.16,25.91
  Bottom 0.254: S2.4 S2.3
SCS_D7  (via drill 0.33)
  Top 0.152: v113.54,53.72 110.1,53.72 STM32F407XX1.46 | v108.84,25.91 108.58,25.65 27.18,25.65 26.67,26.16 R34.1 26.67,32.44 S1.4 | v113.54,25.15 111.12,22.73 v109.6,22.73
  Bottom 0.152: v113.54,53.72 113.79,53.47 113.79,25.4 v113.54,25.15 | v108.84,25.91 108.84,23.88 109.22,23.5 109.22,22.99 109.47,22.73 v109.6,22.73
  Bottom 0.254: S1.4 S1.3
SCS_D8  (via drill 0.33)
  Top 0.152: STM32F407XX1.7 99.33,40.66 99.06,40.39 87.88,40.39 v87.5,40.77 | R38.1 81.61,31.5 S5.4
  Bottom 0.152: v87.5,40.77 83.24,40.77 82.6,41.4
  Bottom 0.254: S5.4 82.6,41.4 S5.3
SCS_D9
  Top 0.152: STM32F407XX1.8 99.83,40.52 99.31,40.01 73.61,40.01 S4.3 | R37.1 67.64,31.5 S4.4
  Bottom 0.254: S4.4 S4.3
SCS_D10
  Top 0.152: STM32F407XX1.9 100.33,40.26 99.69,39.62 60.02,39.62 S3.3 | S3.4 54.61,32.44 54.61,29.59 R36.1
  Bottom 0.254: S3.4 S3.3
SDA  (via drill 0.33)
  Top 0.152: STM32F407XX1.48 111.19,54.67 111.38,54.86 111.38,61.72 111.12,61.98 v108.71,61.98
  Bottom 0.152: v108.71,61.98 97.96,61.98 C27.2
  Bottom 0.254: U1.5 90.04,66.29 90.77,65.57 R13.1 94.11,65.57 C27.2
SW_USER  (via drill 0.33)
  Top 0.152: STM32F407XX1.23 107.33,41.01 107.95,40.39 110.11,40.39 110.49,40.01 110.49,29.34 110.11,28.96 97.92,28.96 v97.41,29.46
  Bottom 0.152: v97.41,29.46 97.03,29.46
  Bottom 0.254: R8.1 96.81,30.06 v97.41,29.46
SWCLK
  Top 0.254: STM32F407XX1.76 93.64,55.67 R12.2
SWDIO
  Top 0.254: STM32F407XX1.72 97.83,58.59 R14.2
USB_D_N
  Top 0.152: STM32F407XX1.70 98.83,65.59 R6.2
USB_D_PP
  Top 0.152: STM32F407XX1.71 98.33,65.28 R7.2
VDDA  (via drill 0.33)
  Top 0.254: STM32F407XX1.22 106.83,43.08 v107.19,43.43 | v107.44,49.53 106.17,49.53 | 106.17,49.53 v105.66,49.53 | v101.73,48.01 102.74,49.02 105.66,49.02 106.17,49.53
  Bottom 0.254: C12.1 C14.2 108.24,46.01 108.33,46.1 108.33,48.9 108.08,49.15 107.82,49.15 v107.44,49.53 | C12.1 106.39,46.01 | v105.66,49.53 104.78,49.53 FB1.2 | v107.19,43.43 107.19,44.2 106.05,45.34 106.05,45.76 C12.1 | R1.1 100.67,46.95 v101.73,48.01
VREF  (via drill 0.33)
  Top 0.254: STM32F407XX1.21 106.33,44.04 v106.17,44.2
  Bottom 0.254: R1.2 C15.1 C13.2 104.48,45.25 105.28,44.45 105.92,44.45 v106.17,44.2

### Text on the board
tPlace: MuteBox rev B | (c) Eran Rundstein 2015